# Altium project HPBIController.PrjPCB (part 2 of 5)

## Sheet Bank0-13-33.SchDoc: 02290_Sonoma_Controller
size B; ApprovedBy: J Johnson; CheckedBy: J Johnson; Author: sdfasdfdfAEFfasdFfaF; DrawnBy: J Johnson; Organization: Opsero Electronic Design; Address1: 21-915 Av. Marguerite-Bourgeoys; Address2: Québec (QC); Address3: G1S 3X4; DocumentNumber: OP009-001-SCH; Revision: B-1; SheetNumber: 07; SheetTotal: 16; Tel1: (581) 308-8830; Tel2: (581) 308-8830; Project: 02290_Sonoma_Controller; CheckedDate: 2013-12-13; Sheet: Bank0, Bank13 & Bank33; PageSetup: Record=PageOptions|CenterHorizontal=True|CenterVertical=True|PrintScale=1.08|XCorrection=1.00|YCorrection=1.00|PrintKind=0|BorderSize=5000000|LeftOffset=0|BottomOffset=0|Orientation=2|PaperLength=1000|PaperWidth=1000|Scale=100|PaperSource=7|PrintQuality=-4|MediaType=1|DitherType=10|PaperKind=Tabloid     [11 x 17 in]|PrintScaleMode=1; DrawDate: 2013-12-13; SchTitle: 02290_Sonoma_Controller; RevDescription: Removed QSPI, JP4/5, temp mon, JP6, U31; RevDate: 2019-05-24; RevBy: J Johnson; RevDescription2: Replaced D1 with RB521S30, J2 with L834-1G1T-S7; RevDescription3: Replaced FETs with TSM900N06CW RPG
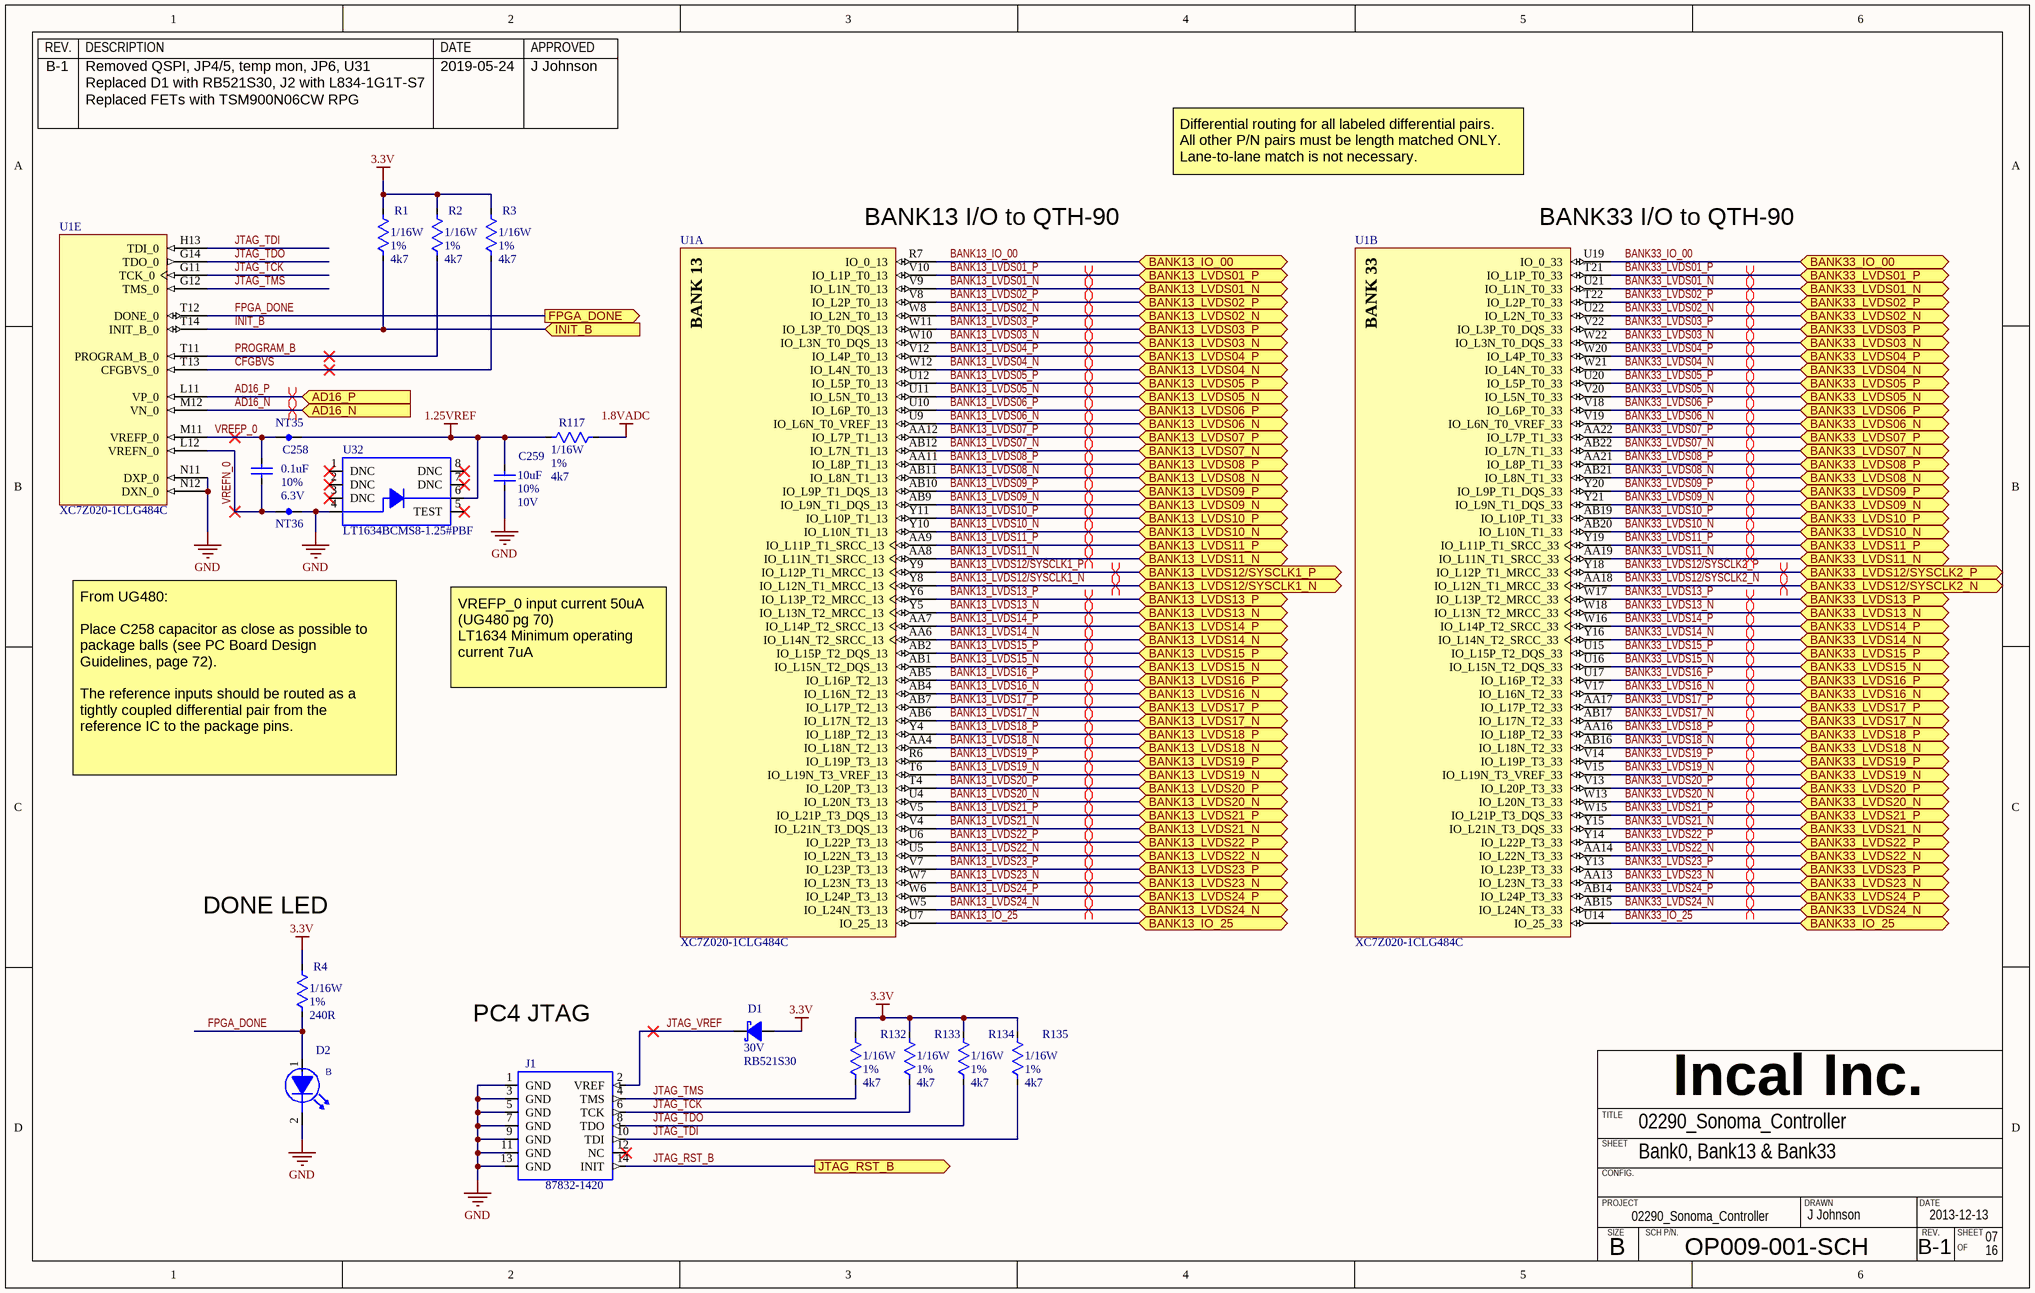
[diagram p1: Bank0-13-33.SchDoc]

### Parts
C258  value 0.1uF  Tolerance: 10%  Voltage: 6.3V  [CAPC0603X33N]  (hidden comment: CAPACITOR_NP_TYPE1)
C259  value 10uF  Tolerance: 10%  Voltage: 10V  [CAPC1608X38N]  (hidden comment: CAPACITOR_NP_TYPE1)
D1  value RB521S30  Voltage: 30V  [SOD15080X70]  (hidden comment: DIODE_SCHOTTKY_TYPE1)
D2  LED_BLU  [LEDM1608X38N-BLU]  (value not drawn)
J1  XILINX-JTAG-2x7  [87832-1420]  (value not drawn)
NT35  NET_TIE_1X1  [NET_TIE_1X1]  (value not drawn)  (net tie, no BOM)
NT36  NET_TIE_1X1  [NET_TIE_1X1]  (value not drawn)  (net tie, no BOM)
R1  value 4k7  Power: 1/16W  Tolerance: 1%  [RESC1005X33N]  (hidden comment: *)
R2  value 4k7  Power: 1/16W  Tolerance: 1%  [RESC1005X33N]  (hidden comment: *)
R3  value 4k7  Power: 1/16W  Tolerance: 1%  [RESC1005X33N]  (hidden comment: *)
R4  value 240R  Power: 1/16W  Tolerance: 1%  [RESC1005X33N]  (hidden comment: *)
R117  value 4k7  Power: 1/16W  Tolerance: 1%  [RESC1005X33N]  (hidden comment: *)
R132  value 4k7  Power: 1/16W  Tolerance: 1%  [RESC1005X33N]  (hidden comment: *)
R133  value 4k7  Power: 1/16W  Tolerance: 1%  [RESC1005X33N]  (hidden comment: *)
R134  value 4k7  Power: 1/16W  Tolerance: 1%  [RESC1005X33N]  (hidden comment: *)
R135  value 4k7  Power: 1/16W  Tolerance: 1%  [RESC1005X33N]  (hidden comment: *)
U1  XC7Z020-1CLG484C  [CLG484]  (parts A,B,E of 10)
U32  Mfg Part Number 1: LT1634BCMS8-1.25#PBF  [SOP65P490X110-8N]  (hidden comment: LT1634)

### Ports
AD16_N (in), AD16_P (in), BANK13_IO_00 (bidir), BANK13_IO_25 (bidir), BANK13_LVDS01_N (bidir), BANK13_LVDS01_P (bidir), BANK13_LVDS02_N (bidir), BANK13_LVDS02_P (bidir), BANK13_LVDS03_N (bidir), BANK13_LVDS03_P (bidir), BANK13_LVDS04_N (bidir), BANK13_LVDS04_P (bidir), BANK13_LVDS05_N (bidir), BANK13_LVDS05_P (bidir), BANK13_LVDS06_N (bidir), BANK13_LVDS06_P (bidir), BANK13_LVDS07_N (bidir), BANK13_LVDS07_P (bidir), BANK13_LVDS08_N (bidir), BANK13_LVDS08_P (bidir), BANK13_LVDS09_N (bidir), BANK13_LVDS09_P (bidir), BANK13_LVDS10_N (bidir), BANK13_LVDS10_P (bidir), BANK13_LVDS11_N (bidir), BANK13_LVDS11_P (bidir), BANK13_LVDS12/SYSCLK1_N (bidir), BANK13_LVDS12/SYSCLK1_P (bidir), BANK13_LVDS13_N (bidir), BANK13_LVDS13_P (bidir), BANK13_LVDS14_N (bidir), BANK13_LVDS14_P (bidir), BANK13_LVDS15_N (bidir), BANK13_LVDS15_P (bidir), BANK13_LVDS16_N (bidir), BANK13_LVDS16_P (bidir), BANK13_LVDS17_N (bidir), BANK13_LVDS17_P (bidir), BANK13_LVDS18_N (bidir), BANK13_LVDS18_P (bidir), BANK13_LVDS19_N (bidir), BANK13_LVDS19_P (bidir), BANK13_LVDS20_N (bidir), BANK13_LVDS20_P (bidir), BANK13_LVDS21_N (bidir), BANK13_LVDS21_P (bidir), BANK13_LVDS22_N (bidir), BANK13_LVDS22_P (bidir), BANK13_LVDS23_N (bidir), BANK13_LVDS23_P (bidir), BANK13_LVDS24_N (bidir), BANK13_LVDS24_P (bidir), BANK33_IO_00 (bidir), BANK33_IO_25 (bidir), BANK33_LVDS01_N (bidir), BANK33_LVDS01_P (bidir), BANK33_LVDS02_N (bidir), BANK33_LVDS02_P (bidir), BANK33_LVDS03_N (bidir), BANK33_LVDS03_P (bidir), BANK33_LVDS04_N (bidir), BANK33_LVDS04_P (bidir), BANK33_LVDS05_N (bidir), BANK33_LVDS05_P (bidir), BANK33_LVDS06_N (bidir), BANK33_LVDS06_P (bidir), BANK33_LVDS07_N (bidir), BANK33_LVDS07_P (bidir), BANK33_LVDS08_N (bidir), BANK33_LVDS08_P (bidir), BANK33_LVDS09_N (bidir), BANK33_LVDS09_P (bidir), BANK33_LVDS10_N (bidir), BANK33_LVDS10_P (bidir), BANK33_LVDS11_N (bidir), BANK33_LVDS11_P (bidir), BANK33_LVDS12/SYSCLK2_N (bidir), BANK33_LVDS12/SYSCLK2_P (bidir), BANK33_LVDS13_N (bidir), BANK33_LVDS13_P (bidir), BANK33_LVDS14_N (bidir), BANK33_LVDS14_P (bidir), BANK33_LVDS15_N (bidir), BANK33_LVDS15_P (bidir), BANK33_LVDS16_N (bidir), BANK33_LVDS16_P (bidir), BANK33_LVDS17_N (bidir), BANK33_LVDS17_P (bidir), BANK33_LVDS18_N (bidir), BANK33_LVDS18_P (bidir), BANK33_LVDS19_N (bidir), BANK33_LVDS19_P (bidir), BANK33_LVDS20_N (bidir), BANK33_LVDS20_P (bidir), BANK33_LVDS21_N (bidir), BANK33_LVDS21_P (bidir), BANK33_LVDS22_N (bidir), BANK33_LVDS22_P (bidir), BANK33_LVDS23_N (bidir), BANK33_LVDS23_P (bidir), BANK33_LVDS24_N (bidir), BANK33_LVDS24_P (bidir), FPGA_DONE (out), INIT_B (in), JTAG_RST_B (out)

### Nets
1.8VADC: R117.2
1.25VREF: C259.1 NT35.2 R117.1 U32.6(VOUT)
3.3V: D1.1(A) R1.2 R2.2 R3.2 R4.2 R132.2 R133.2 R134.2 R135.2
GND: C259.2 D2.2(K) J1.1(GND) J1.3(GND) J1.5(GND) J1.7(GND) J1.9(GND) J1.11(GND) J1.13(GND) NT36.2 U1.N11(DXP_0) U1.N12(DXN_0) U32.4(GND)
AD16_N: U1.M12(VN_0) ; port AD16_N
AD16_P: U1.L11(VP_0) ; port AD16_P
BANK13_IO_00: U1.R7(IO_0_13) ; port BANK13_IO_00
BANK13_IO_25: U1.U7(IO_25_13) ; port BANK13_IO_25
BANK13_LVDS01_N: U1.V9(IO_L1N_T0_13) ; port BANK13_LVDS01_N
BANK13_LVDS01_P: U1.V10(IO_L1P_T0_13) ; port BANK13_LVDS01_P
BANK13_LVDS02_N: U1.W8(IO_L2N_T0_13) ; port BANK13_LVDS02_N
BANK13_LVDS02_P: U1.V8(IO_L2P_T0_13) ; port BANK13_LVDS02_P
BANK13_LVDS03_N: U1.W10(IO_L3N_T0_DQS_13) ; port BANK13_LVDS03_N
BANK13_LVDS03_P: U1.W11(IO_L3P_T0_DQS_13) ; port BANK13_LVDS03_P
BANK13_LVDS04_N: U1.W12(IO_L4N_T0_13) ; port BANK13_LVDS04_N
BANK13_LVDS04_P: U1.V12(IO_L4P_T0_13) ; port BANK13_LVDS04_P
BANK13_LVDS05_N: U1.U11(IO_L5N_T0_13) ; port BANK13_LVDS05_N
BANK13_LVDS05_P: U1.U12(IO_L5P_T0_13) ; port BANK13_LVDS05_P
BANK13_LVDS06_N: U1.U9(IO_L6N_T0_VREF_13) ; port BANK13_LVDS06_N
BANK13_LVDS06_P: U1.U10(IO_L6P_T0_13) ; port BANK13_LVDS06_P
BANK13_LVDS07_N: U1.AB12(IO_L7N_T1_13) ; port BANK13_LVDS07_N
BANK13_LVDS07_P: U1.AA12(IO_L7P_T1_13) ; port BANK13_LVDS07_P
BANK13_LVDS08_N: U1.AB11(IO_L8N_T1_13) ; port BANK13_LVDS08_N
BANK13_LVDS08_P: U1.AA11(IO_L8P_T1_13) ; port BANK13_LVDS08_P
BANK13_LVDS09_N: U1.AB9(IO_L9N_T1_DQS_13) ; port BANK13_LVDS09_N
BANK13_LVDS09_P: U1.AB10(IO_L9P_T1_DQS_13) ; port BANK13_LVDS09_P
BANK13_LVDS10_N: U1.Y10(IO_L10N_T1_13) ; port BANK13_LVDS10_N
BANK13_LVDS10_P: U1.Y11(IO_L10P_T1_13) ; port BANK13_LVDS10_P
BANK13_LVDS11_N: U1.AA8(IO_L11N_T1_SRCC_13) ; port BANK13_LVDS11_N
BANK13_LVDS11_P: U1.AA9(IO_L11P_T1_SRCC_13) ; port BANK13_LVDS11_P
BANK13_LVDS12/SYSCLK1_N: U1.Y8(IO_L12N_T1_MRCC_13) ; port BANK13_LVDS12/SYSCLK1_N
BANK13_LVDS12/SYSCLK1_P: U1.Y9(IO_L12P_T1_MRCC_13) ; port BANK13_LVDS12/SYSCLK1_P
BANK13_LVDS13_N: U1.Y5(IO_L13N_T2_MRCC_13) ; port BANK13_LVDS13_N
BANK13_LVDS13_P: U1.Y6(IO_L13P_T2_MRCC_13) ; port BANK13_LVDS13_P
BANK13_LVDS14_N: U1.AA6(IO_L14N_T2_SRCC_13) ; port BANK13_LVDS14_N
BANK13_LVDS14_P: U1.AA7(IO_L14P_T2_SRCC_13) ; port BANK13_LVDS14_P
BANK13_LVDS15_N: U1.AB1(IO_L15N_T2_DQS_13) ; port BANK13_LVDS15_N
BANK13_LVDS15_P: U1.AB2(IO_L15P_T2_DQS_13) ; port BANK13_LVDS15_P
BANK13_LVDS16_N: U1.AB4(IO_L16N_T2_13) ; port BANK13_LVDS16_N
BANK13_LVDS16_P: U1.AB5(IO_L16P_T2_13) ; port BANK13_LVDS16_P
BANK13_LVDS17_N: U1.AB6(IO_L17N_T2_13) ; port BANK13_LVDS17_N
BANK13_LVDS17_P: U1.AB7(IO_L17P_T2_13) ; port BANK13_LVDS17_P
BANK13_LVDS18_N: U1.AA4(IO_L18N_T2_13) ; port BANK13_LVDS18_N
BANK13_LVDS18_P: U1.Y4(IO_L18P_T2_13) ; port BANK13_LVDS18_P
BANK13_LVDS19_N: U1.T6(IO_L19N_T3_VREF_13) ; port BANK13_LVDS19_N
BANK13_LVDS19_P: U1.R6(IO_L19P_T3_13) ; port BANK13_LVDS19_P
BANK13_LVDS20_N: U1.U4(IO_L20N_T3_13) ; port BANK13_LVDS20_N
BANK13_LVDS20_P: U1.T4(IO_L20P_T3_13) ; port BANK13_LVDS20_P
BANK13_LVDS21_N: U1.V4(IO_L21N_T3_DQS_13) ; port BANK13_LVDS21_N
BANK13_LVDS21_P: U1.V5(IO_L21P_T3_DQS_13) ; port BANK13_LVDS21_P
BANK13_LVDS22_N: U1.U5(IO_L22N_T3_13) ; port BANK13_LVDS22_N
BANK13_LVDS22_P: U1.U6(IO_L22P_T3_13) ; port BANK13_LVDS22_P
BANK13_LVDS23_N: U1.W7(IO_L23N_T3_13) ; port BANK13_LVDS23_N
BANK13_LVDS23_P: U1.V7(IO_L23P_T3_13) ; port BANK13_LVDS23_P
BANK13_LVDS24_N: U1.W5(IO_L24N_T3_13) ; port BANK13_LVDS24_N
BANK13_LVDS24_P: U1.W6(IO_L24P_T3_13) ; port BANK13_LVDS24_P
BANK33_IO_00: U1.U19(IO_0_33) ; port BANK33_IO_00
BANK33_IO_25: U1.U14(IO_25_33) ; port BANK33_IO_25
BANK33_LVDS01_N: U1.U21(IO_L1N_T0_33) ; port BANK33_LVDS01_N
BANK33_LVDS01_P: U1.T21(IO_L1P_T0_33) ; port BANK33_LVDS01_P
BANK33_LVDS02_N: U1.U22(IO_L2N_T0_33) ; port BANK33_LVDS02_N
BANK33_LVDS02_P: U1.T22(IO_L2P_T0_33) ; port BANK33_LVDS02_P
BANK33_LVDS03_N: U1.W22(IO_L3N_T0_DQS_33) ; port BANK33_LVDS03_N
BANK33_LVDS03_P: U1.V22(IO_L3P_T0_DQS_33) ; port BANK33_LVDS03_P
BANK33_LVDS04_N: U1.W21(IO_L4N_T0_33) ; port BANK33_LVDS04_N
BANK33_LVDS04_P: U1.W20(IO_L4P_T0_33) ; port BANK33_LVDS04_P
BANK33_LVDS05_N: U1.V20(IO_L5N_T0_33) ; port BANK33_LVDS05_N
BANK33_LVDS05_P: U1.U20(IO_L5P_T0_33) ; port BANK33_LVDS05_P
BANK33_LVDS06_N: U1.V19(IO_L6N_T0_VREF_33) ; port BANK33_LVDS06_N
BANK33_LVDS06_P: U1.V18(IO_L6P_T0_33) ; port BANK33_LVDS06_P
BANK33_LVDS07_N: U1.AB22(IO_L7N_T1_33) ; port BANK33_LVDS07_N
BANK33_LVDS07_P: U1.AA22(IO_L7P_T1_33) ; port BANK33_LVDS07_P
BANK33_LVDS08_N: U1.AB21(IO_L8N_T1_33) ; port BANK33_LVDS08_N
BANK33_LVDS08_P: U1.AA21(IO_L8P_T1_33) ; port BANK33_LVDS08_P
BANK33_LVDS09_N: U1.Y21(IO_L9N_T1_DQS_33) ; port BANK33_LVDS09_N
BANK33_LVDS09_P: U1.Y20(IO_L9P_T1_DQS_33) ; port BANK33_LVDS09_P
BANK33_LVDS10_N: U1.AB20(IO_L10N_T1_33) ; port BANK33_LVDS10_N
BANK33_LVDS10_P: U1.AB19(IO_L10P_T1_33) ; port BANK33_LVDS10_P
BANK33_LVDS11_N: U1.AA19(IO_L11N_T1_SRCC_33) ; port BANK33_LVDS11_N
BANK33_LVDS11_P: U1.Y19(IO_L11P_T1_SRCC_33) ; port BANK33_LVDS11_P
BANK33_LVDS12/SYSCLK2_N: U1.AA18(IO_L12N_T1_MRCC_33) ; port BANK33_LVDS12/SYSCLK2_N
BANK33_LVDS12/SYSCLK2_P: U1.Y18(IO_L12P_T1_MRCC_33) ; port BANK33_LVDS12/SYSCLK2_P
BANK33_LVDS13_N: U1.W18(IO_L13N_T2_MRCC_33) ; port BANK33_LVDS13_N
BANK33_LVDS13_P: U1.W17(IO_L13P_T2_MRCC_33) ; port BANK33_LVDS13_P
BANK33_LVDS14_N: U1.Y16(IO_L14N_T2_SRCC_33) ; port BANK33_LVDS14_N
BANK33_LVDS14_P: U1.W16(IO_L14P_T2_SRCC_33) ; port BANK33_LVDS14_P
BANK33_LVDS15_N: U1.U16(IO_L15N_T2_DQS_33) ; port BANK33_LVDS15_N
BANK33_LVDS15_P: U1.U15(IO_L15P_T2_DQS_33) ; port BANK33_LVDS15_P
BANK33_LVDS16_N: U1.V17(IO_L16N_T2_33) ; port BANK33_LVDS16_N
BANK33_LVDS16_P: U1.U17(IO_L16P_T2_33) ; port BANK33_LVDS16_P
BANK33_LVDS17_N: U1.AB17(IO_L17N_T2_33) ; port BANK33_LVDS17_N
BANK33_LVDS17_P: U1.AA17(IO_L17P_T2_33) ; port BANK33_LVDS17_P
BANK33_LVDS18_N: U1.AB16(IO_L18N_T2_33) ; port BANK33_LVDS18_N
BANK33_LVDS18_P: U1.AA16(IO_L18P_T2_33) ; port BANK33_LVDS18_P
BANK33_LVDS19_N: U1.V15(IO_L19N_T3_VREF_33) ; port BANK33_LVDS19_N
BANK33_LVDS19_P: U1.V14(IO_L19P_T3_33) ; port BANK33_LVDS19_P
BANK33_LVDS20_N: U1.W13(IO_L20N_T3_33) ; port BANK33_LVDS20_N
BANK33_LVDS20_P: U1.V13(IO_L20P_T3_33) ; port BANK33_LVDS20_P
BANK33_LVDS21_N: U1.Y15(IO_L21N_T3_DQS_33) ; port BANK33_LVDS21_N
BANK33_LVDS21_P: U1.W15(IO_L21P_T3_DQS_33) ; port BANK33_LVDS21_P
BANK33_LVDS22_N: U1.AA14(IO_L22N_T3_33) ; port BANK33_LVDS22_N
BANK33_LVDS22_P: U1.Y14(IO_L22P_T3_33) ; port BANK33_LVDS22_P
BANK33_LVDS23_N: U1.AA13(IO_L23N_T3_33) ; port BANK33_LVDS23_N
BANK33_LVDS23_P: U1.Y13(IO_L23P_T3_33) ; port BANK33_LVDS23_P
BANK33_LVDS24_N: U1.AB15(IO_L24N_T3_33) ; port BANK33_LVDS24_N
BANK33_LVDS24_P: U1.AB14(IO_L24P_T3_33) ; port BANK33_LVDS24_P
CFGBVS: R3.1 U1.T13(CFGBVS_0)
FPGA_DONE: D2.1(A) R4.1 U1.T12(DONE_0) ; port FPGA_DONE
INIT_B: R1.1 U1.T14(INIT_B_0) ; port INIT_B
JTAG_RST_B: J1.14(INIT) ; port JTAG_RST_B
JTAG_TCK: J1.6(TCK) R133.1 U1.G11(TCK_0)
JTAG_TDI: J1.10(TDI) R135.1 U1.H13(TDI_0)
JTAG_TDO: J1.8(TDO) R134.1 U1.G14(TDO_0)
JTAG_TMS: J1.4(TMS) R132.1 U1.G12(TMS_0)
JTAG_VREF: D1.2(K) J1.2(VREF)
PROGRAM_B: R2.1 U1.T11(PROGRAM_B_0)
VREFN_0: C258.2 NT36.1 U1.L12(VREFN_0)
VREFP_0: C258.1 NT35.1 U1.M11(VREFP_0)

Not connected (* = marked no-connect by the designer): J1 12(NC)*; U32 1(DNC)* 2(DNC)* 3(DNC)* 5(TEST)* 7(DNC)* 8(DNC)*

### Layout directives
differential pair: AD16_N, AD16_P, BANK13_LVDS01_N, BANK13_LVDS01_P, BANK13_LVDS02_N, BANK13_LVDS02_P, BANK13_LVDS03_N, BANK13_LVDS03_P, BANK13_LVDS04_N, BANK13_LVDS04_P, BANK13_LVDS05_N, BANK13_LVDS05_P, BANK13_LVDS06_N, BANK13_LVDS06_P, BANK13_LVDS07_N, BANK13_LVDS07_P, BANK13_LVDS08_N, BANK13_LVDS08_P, BANK13_LVDS09_N, BANK13_LVDS09_P, BANK13_LVDS10_N, BANK13_LVDS10_P, BANK13_LVDS11_N, BANK13_LVDS11_P, BANK13_LVDS12/SYSCLK1_N, BANK13_LVDS12/SYSCLK1_P, BANK13_LVDS13_N, BANK13_LVDS13_P, BANK13_LVDS14_N, BANK13_LVDS14_P, BANK13_LVDS15_N, BANK13_LVDS15_P, BANK13_LVDS16_N, BANK13_LVDS16_P, BANK13_LVDS17_N, BANK13_LVDS17_P, BANK13_LVDS18_N, BANK13_LVDS18_P, BANK13_LVDS19_N, BANK13_LVDS19_P, BANK13_LVDS20_N, BANK13_LVDS20_P, BANK13_LVDS21_N, BANK13_LVDS21_P, BANK13_LVDS22_N, BANK13_LVDS22_P, BANK13_LVDS23_N, BANK13_LVDS23_P, BANK13_LVDS24_N, BANK13_LVDS24_P, BANK33_LVDS01_N, BANK33_LVDS01_P, BANK33_LVDS02_N, BANK33_LVDS02_P, BANK33_LVDS03_N, BANK33_LVDS03_P, BANK33_LVDS04_N, BANK33_LVDS04_P, BANK33_LVDS05_N, BANK33_LVDS05_P, BANK33_LVDS06_N, BANK33_LVDS06_P, BANK33_LVDS07_N, BANK33_LVDS07_P, BANK33_LVDS08_N, BANK33_LVDS08_P, BANK33_LVDS09_N, BANK33_LVDS09_P, BANK33_LVDS10_N, BANK33_LVDS10_P, BANK33_LVDS11_N, BANK33_LVDS11_P, BANK33_LVDS12/SYSCLK2_N, BANK33_LVDS12/SYSCLK2_P, BANK33_LVDS13_N, BANK33_LVDS13_P, BANK33_LVDS14_N, BANK33_LVDS14_P, BANK33_LVDS15_N, BANK33_LVDS15_P, BANK33_LVDS16_N, BANK33_LVDS16_P, BANK33_LVDS17_N, BANK33_LVDS17_P, BANK33_LVDS18_N, BANK33_LVDS18_P, BANK33_LVDS19_N, BANK33_LVDS19_P, BANK33_LVDS20_N, BANK33_LVDS20_P, BANK33_LVDS21_N, BANK33_LVDS21_P, BANK33_LVDS22_N, BANK33_LVDS22_P, BANK33_LVDS23_N, BANK33_LVDS23_P, BANK33_LVDS24_N, BANK33_LVDS24_P

### Notes on the sheet
- (near U1) BANK13 I/O to QTH-90
- Differential routing for all labeled differential pairs.
  All other P/N pairs must be length matched ONLY.
  Lane-to-lane match is not necessary.
- (near U1) BANK33 I/O to QTH-90
- VREFP_0 input current 50uA (UG480 pg 70)
  LT1634 Minimum operating current 7uA
- From UG480:
  Place C258 capacitor as close as possible to package balls (see PC Board Design Guidelines, page 72).
  The reference inputs should be routed as a tightly coupled differential pair from the
  reference IC to the package pins.
- (near R4) DONE LED
- PC4 JTAG
- REV.
- DESCRIPTION
- DATE
- APPROVED
- Incal Inc.
- SHEET
- TITLE
- CONFIG.
- PROJECT
- SIZE
- SCH P/N.
- DRAWN
- B
- OF
- (in symbol LTST-C191TBKT) B
- (in symbol XC7Z020-1CLG484C, part A) BANK 13
- (in symbol XC7Z020-1CLG484C, part B) BANK 33

### Library data of the parts
C258 = C0201_0.1uF_10%_6.3V_X5R: Capacitor ceramic, X5R, 0.1uF, 6.3V, 10%, -55 to +125 C, EIA0201; Manufacturer 1: Murata; Mfg Part Number 1: GRM033R60J104KE19D; EIA(I) Package: 0201; EIA(M) Package: 0603; ASSY: USED; Status: Active; Power: *; Current: *; Part Ref: C0201_0.1uF_10%_6.3V_X5R; Comment_1: *; RoHs: True; Operating Temp: -55 to +85 C
C259 = C0603_10uF_10%_10V_X5R: Capacitor ceramic, X5R, 10uF, 10V, 10%, -55 to +85 C, EIA0603; Manufacturer 1: TDK Corporation; Mfg Part Number 1: C1608X5R1A106K080AC; EIA(I) Package: 0603; EIA(M) Package: 1608; ASSY: USED; Status: Active; Power: *; Current: *; Part Ref: C0603_10uF_10%_10V_X5R; Comment_1: *; RoHs: True; Operating Temp: -55 to +85 C
D1 = RB521S30: Diode schottky, 30V, 200mA, SOD-523F; Manufacturer 1: ON Semiconductor; Status: Active; Power: *; Current: 200mA; EIA(I) Package: *; EIA(M) Package: *; Part Ref: RB521S30; Tolerance: *; RoHs: True; Package: SOD-523F; Datasheet 1: https://www.onsemi.com/pub/Collateral/RB521S30-D.pdf; Mfg Part Number 1: RB521S30; Operating Temp: -55 to +125 C
D2 = LTST-C191TBKT: Led, Blue, 150mcd, SMT, LTST-C191TBKT, -20 to +80 C, 0603; Manufacturer 1: LITE-ON; EIA(I) Package: 0603; ASSY: USED; Power: 120mW; Current: 20mA; Voltage: 3.2V; Status: Active; EIA(M) Package: *; Part Ref: LTST-C191TBKT; Tolerance: *; Package: *; RoHs: True; Value: LTST-C191TBKT; Operating Temp: -20 to +80 C; Mfg Part Number 1: LTST-C191TBKT
J1 = JTAG_XILINX_SMT_2X7: Connector Header 2mm, 2x7, SMT, Keyed, Shrouded, 0V, 0A, -55 to +105 C; Manufacturer 1: Molex; ASSY: USED; Power: Pow; Comment_1: Com; Value: 87832-1420; Status: Active; EIA(I) Package: *; EIA(M) Package: *; Part Ref: JTAG_XILINX_SMT_2X7; Current: 0A; Tolerance: *; Voltage: 0V; Package: *; RoHs: True; Operating Temp: -55 to +105 C; Mfg Part Number 1: 87832-1420; Datasheet 1: ..\datasheet\Connector\Molex\Header\87831-1420\2012-10-25\
NT35 NT36 = NET_TIE_1X1: Net Tie 1 to 1; ASSY: USED; Status: Active; Power: *; Current: *; EIA(I) Package: *; EIA(M) Package: *; Part Ref: NET_TIE_1X1; Comment_1: *; RoHs: True; Value: NET_TIE; Tolerance: *; Voltage: *
R1-R3 R117 R132-R135 = R0402_4k70_1%: Resistor, 4k7, 1/16W, 1%, -55 to +155 C, EIA0402; Manufacturer 1: Yageo; Mfg Part Number 1: RC0402FR-074k7L; EIA(I) Package: 0402; EIA(M) Package: 1005; Voltage: 50V; ASSY: USED; Status: Active; Part Ref: R0402_4k70_1%; Current: *; Comment_1: *; RoHs: True; Operating Temp: -55 to +155 C; Datasheet 1: ..\datasheet\Resistor\Yaego\Thick_Film\RC0402\2012-03-29; Manufacturer 2: Vishay Dale; Mfg Part Number 2: CRCW04024k70FKED; Datasheet 2: ..\datasheet\Resistor\Vishay Dale\CRC\2012-03-29
R4 = R0402_240R_1%: Resistor, 240R, 1/16W, 1%, -50 to +155 C, EIA0402, EIA(M)1005; Manufacturer 1: Vishay Dale; Mfg Part Number 1: CRCW0402240RFKED; EIA(I) Package: 0402; EIA(M) Package: 1005; Voltage: 50V; ASSY: USED; Status: Active; Part Ref: R0402_240R_1%; Current: *; Comment_1: *; RoHs: True; Operating Temp: -50 to +155 C
U1 = XC7Z020-1CLG484C: 667 MHz Zynq™-7000 AP SoC, 130 PS I/O, 200 FPGA I/O, 484-Ball BGA, Speed Grade 1, Commercial Grade; Manufacturer: Xilinx; Extensible Block RAM (# 36Kb Blocks): 560 KB (140); Flip Flops: 106400; LUTs: 53200; Speed Grade: -1; DatasheetVersion: v1.2; PackageVersion: Rev 1.1; PackageReference: CLG484; PackageDescription: Wire-Bond Chip-Scale BGA, Body 19 x 19 mm, 0.8 mm Pitch; Generic Part Number: XC7Z020; RoHS: True; Mounting Technology: Surface Mount; Code_JEDEC: MO-275-PPAA-2; PartNumber: XC7Z020-1CLG484C; ComponentLink1Description: Datasheet; ComponentLink1URL: http://www.xilinx.com/support/documentation/data_sheets/ds190-Zynq-7000-Overview.pdf; ComponentLink2Description: Package Specification; ComponentLink2URL: http://www.xilinx.com/support/documentation/user_guides/ug865-Zynq-7000-Pkg-Pinout.pdf; ComponentLink3Description: DC and AC Switching Characteristics; ComponentLink3URL: http://www.xilinx.com/support/documentation/data_sheets/ds187-XC7Z010-XC7Z020-Data-Sheet.pdf; ComponentLink4Description: Package File; ComponentLink4URL: http://www.xilinx.com/support/packagefiles/z7packages/xc7z020clg484pkg.txt; ComponentLink5Description: Packaging and Pinout; ComponentLink5URL: http://www.xilinx.com/support/documentation/user_guides/ug865-Zynq-7000-Pkg-Pinout.pdf; ComponentLink6Description: PCB and Layout Guide; ComponentLink6URL: http://www.xilinx.com/support/documentation/user_guides/ug483_7Series_PCB.pdf; Part Ref: XC7Z020-1CLG484C; Status: Active; Value: XC7Z020-1CLG484C; Manufacturer 1: Xilinx; Mfg Part Number 1: XC7Z020-1CLG484C; Package: CLG484
U32 = LT1634BCMS8-1.25#PBF: Reference Shunt 1.25V, 10ppm, 0.05%; Manufacturer 1: Linear Technology; ASSY: USED; Power: Pow; Current: Cur; Voltage: Vol; Status: Active; EIA(I) Package: *; EIA(M) Package: *; Part Ref: LT1634BCMS8-1.25#PBF; Tolerance: ±0.05%; Package: SOT23-5; RoHs: True; Value: 1.25V; Operating Temp: 0 to +70 C

## Sheet DDR3A.SchDoc: 02290_Sonoma_Controller
size B; ApprovedBy: J Johnson; CheckedBy: J Johnson; Author: sdfasdfdfAEFfasdFfaF; DrawnBy: J Johnson; Organization: Opsero Electronic Design; Address1: 21-915 Av. Marguerite-Bourgeoys; Address2: Québec (QC); Address3: G1S 3X4; DocumentNumber: OP009-001-SCH; Revision: B-1; SheetNumber: 03; SheetTotal: 16; Tel1: (581) 308-8830; Tel2: (581) 308-8830; Project: 02290_Sonoma_Controller; CheckedDate: 2013-12-13; Sheet: DDR3 SDRAM Page 1; PageSetup: Record=PageOptions|CenterHorizontal=True|CenterVertical=True|PrintScale=1.08|XCorrection=1.00|YCorrection=1.00|PrintKind=0|BorderSize=5000000|LeftOffset=0|BottomOffset=0|Orientation=2|PaperLength=1000|PaperWidth=1000|Scale=100|PaperSource=7|PrintQuality=-4|MediaType=1|DitherType=10|PaperKind=Tabloid     [11 x 17 in]|PrintScaleMode=1; DrawDate: 2013-12-13; SchTitle: 02290_Sonoma_Controller; RevDescription: Removed QSPI, JP4/5, temp mon, JP6, U31; RevDate: 2019-05-24; RevBy: J Johnson; RevDescription2: Replaced D1 with RB521S30, J2 with L834-1G1T-S7; RevDescription3: Replaced FETs with TSM900N06CW RPG
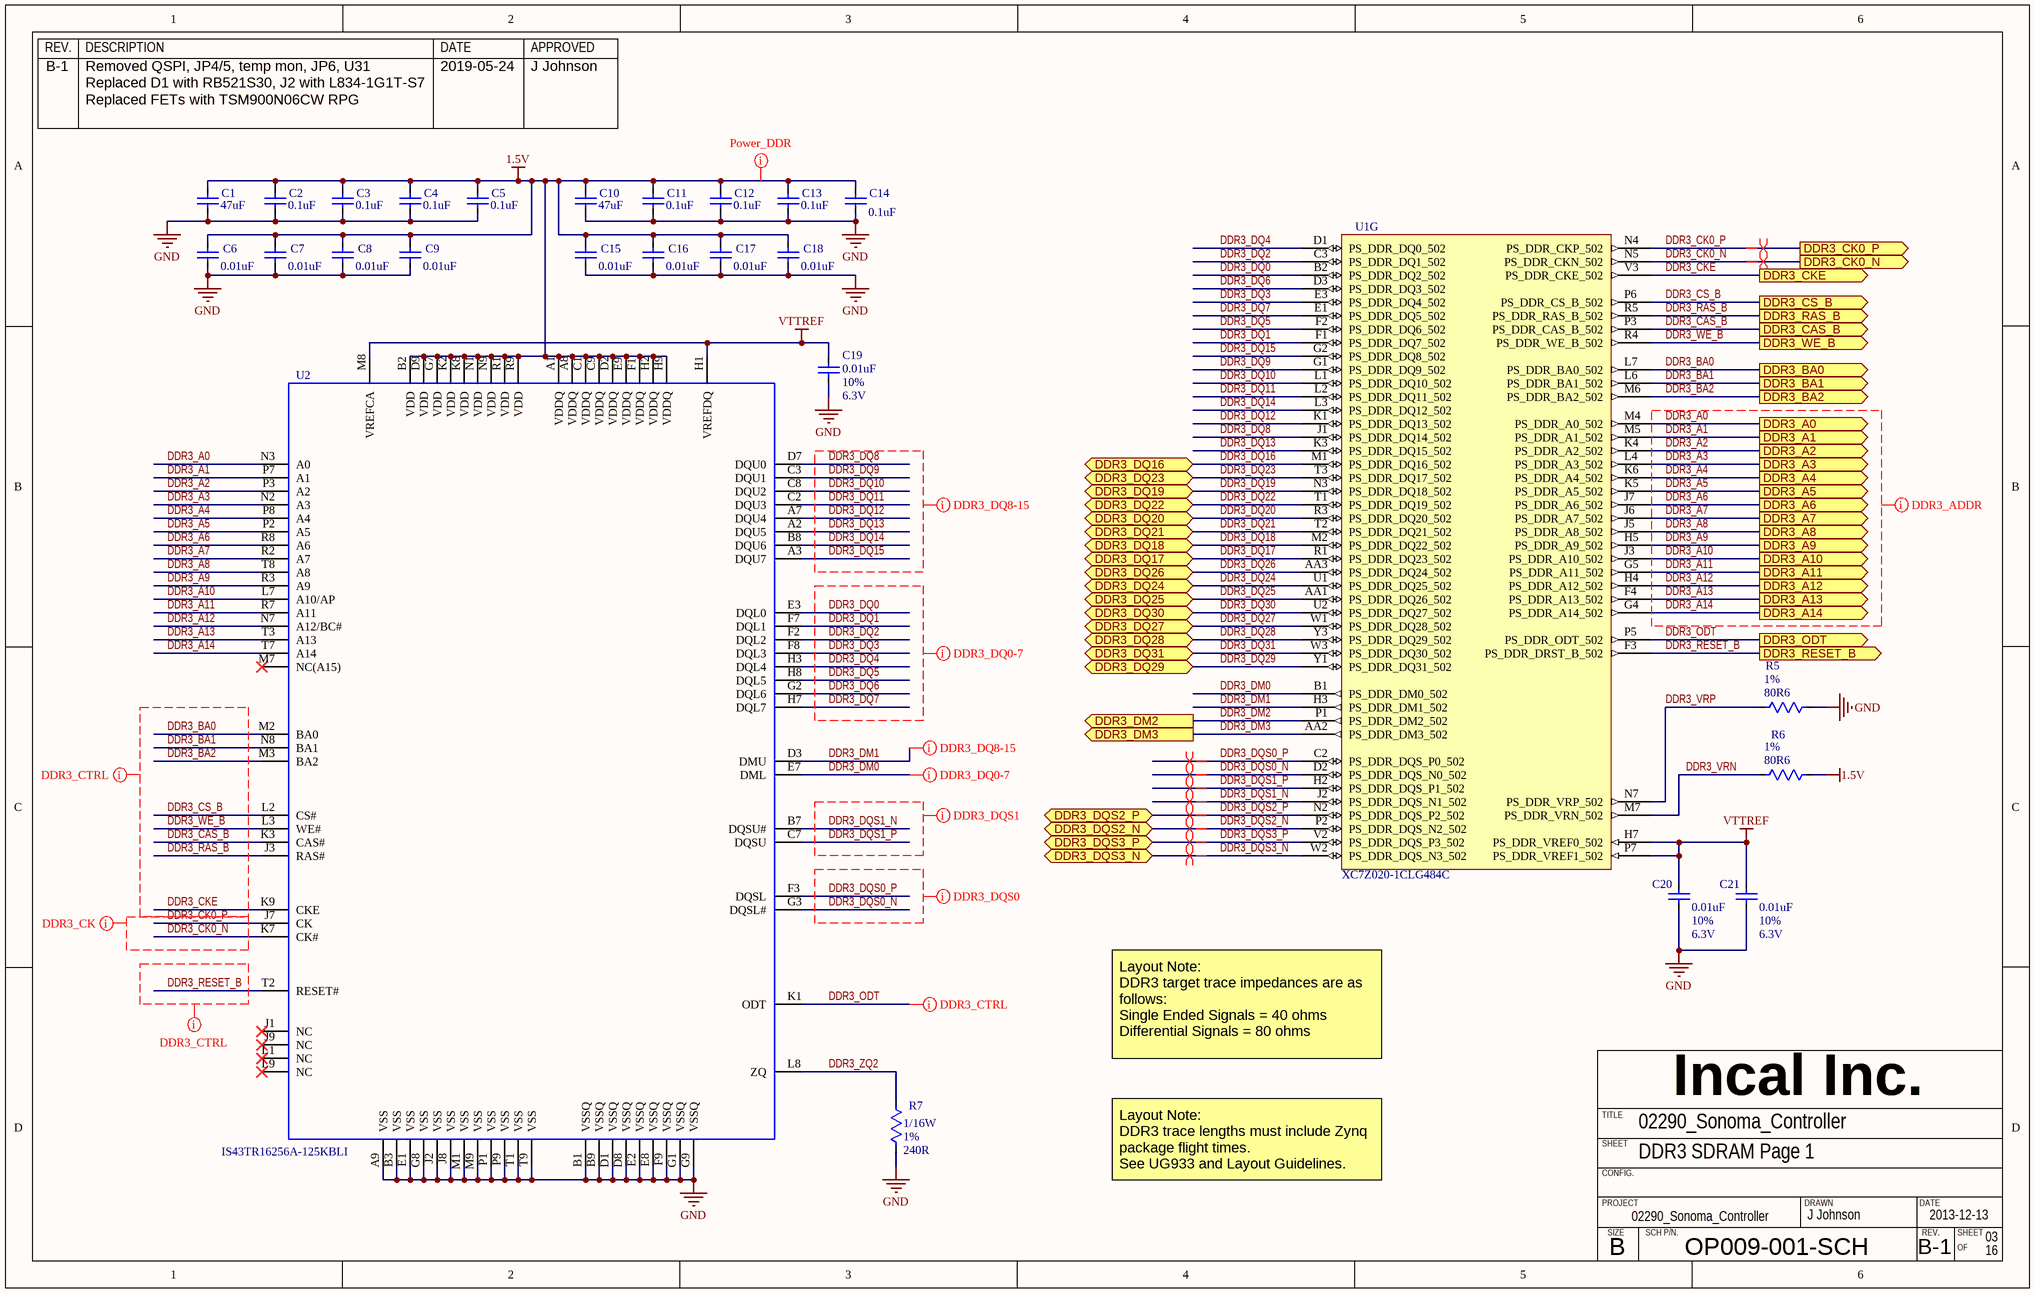
[diagram p2: DDR3A.SchDoc]

### Parts
C1  value 47uF  [CAPC2013X125N]  (hidden comment: CAPACITOR_NP_TYPE1)
C2  value 0.1uF  [CAPC0603X33N]  (hidden comment: CAPACITOR_NP_TYPE1)
C3  value 0.1uF  [CAPC0603X33N]  (hidden comment: CAPACITOR_NP_TYPE1)
C4  value 0.1uF  [CAPC0603X33N]  (hidden comment: CAPACITOR_NP_TYPE1)
C5  value 0.1uF  [CAPC0603X33N]  (hidden comment: CAPACITOR_NP_TYPE1)
C6  value 0.01uF  [CAPC0603X33N]  (hidden comment: CAPACITOR_NP_TYPE1)
C7  value 0.01uF  [CAPC0603X33N]  (hidden comment: CAPACITOR_NP_TYPE1)
C8  value 0.01uF  [CAPC0603X33N]  (hidden comment: CAPACITOR_NP_TYPE1)
C9  value 0.01uF  [CAPC0603X33N]  (hidden comment: CAPACITOR_NP_TYPE1)
C10  value 47uF  [CAPC2013X125N]  (hidden comment: CAPACITOR_NP_TYPE1)
C11  value 0.1uF  [CAPC0603X33N]  (hidden comment: CAPACITOR_NP_TYPE1)
C12  value 0.1uF  [CAPC0603X33N]  (hidden comment: CAPACITOR_NP_TYPE1)
C13  value 0.1uF  [CAPC0603X33N]  (hidden comment: CAPACITOR_NP_TYPE1)
C14  value 0.1uF  [CAPC0603X33N]  (hidden comment: CAPACITOR_NP_TYPE1)
C15  value 0.01uF  [CAPC0603X33N]  (hidden comment: CAPACITOR_NP_TYPE1)
C16  value 0.01uF  [CAPC0603X33N]  (hidden comment: CAPACITOR_NP_TYPE1)
C17  value 0.01uF  [CAPC0603X33N]  (hidden comment: CAPACITOR_NP_TYPE1)
C18  value 0.01uF  [CAPC0603X33N]  (hidden comment: CAPACITOR_NP_TYPE1)
C19  value 0.01uF  Tolerance: 10%  Voltage: 6.3V  [CAPC0603X33N]  (hidden comment: CAPACITOR_NP_TYPE1)
C20  value 0.01uF  Tolerance: 10%  Voltage: 6.3V  [CAPC0603X33N]  (hidden comment: CAPACITOR_NP_TYPE1)
C21  value 0.01uF  Tolerance: 10%  Voltage: 6.3V  [CAPC0603X33N]  (hidden comment: CAPACITOR_NP_TYPE1)
R5  value 80R6  Tolerance: 1%  [RESC1005X33N]  (hidden comment: *)
R6  value 80R6  Tolerance: 1%  [RESC1005X33N]  (hidden comment: *)
R7  value 240R  Power: 1/16W  Tolerance: 1%  [RESC1005X33N]  (hidden comment: *)
U1  XC7Z020-1CLG484C  [CLG484]  (part G of 10)
U2  IS43TR16256A-125KBLI  [BGA96C80P6X16_900X1300X120]

### Ports
DDR3_A0 (out), DDR3_A1 (out), DDR3_A2 (out), DDR3_A3 (out), DDR3_A4 (out), DDR3_A5 (out), DDR3_A6 (out), DDR3_A7 (out), DDR3_A8 (out), DDR3_A9 (out), DDR3_A10 (out), DDR3_A11 (out), DDR3_A12 (out), DDR3_A13 (out), DDR3_A14 (out), DDR3_BA0 (out), DDR3_BA1 (out), DDR3_BA2 (out), DDR3_CAS_B (out), DDR3_CK0_N (out), DDR3_CK0_P (out), DDR3_CKE (out), DDR3_CS_B (out), DDR3_DM2 (out), DDR3_DM3 (out), DDR3_DQ16 (bidir), DDR3_DQ17 (bidir), DDR3_DQ18 (bidir), DDR3_DQ19 (bidir), DDR3_DQ20 (bidir), DDR3_DQ21 (bidir), DDR3_DQ22 (bidir), DDR3_DQ23 (bidir), DDR3_DQ24 (bidir), DDR3_DQ25 (bidir), DDR3_DQ26 (bidir), DDR3_DQ27 (bidir), DDR3_DQ28 (bidir), DDR3_DQ29 (bidir), DDR3_DQ30 (bidir), DDR3_DQ31 (bidir), DDR3_DQS2_N (bidir), DDR3_DQS2_P (bidir), DDR3_DQS3_N (bidir), DDR3_DQS3_P (bidir), DDR3_ODT (out), DDR3_RAS_B (out), DDR3_RESET_B (out), DDR3_WE_B (out)

### Nets
1.5V: C1.1 C2.1 C3.1 C4.1 C5.1 C6.1 C7.1 C8.1 C9.1 C10.1 C11.1 C12.1 C13.1 C14.1 C15.1 C16.1 C17.1 C18.1 R6.1 U2.A1(VDDQ) U2.A8(VDDQ) U2.B2(VDD) U2.C1(VDDQ) U2.C9(VDDQ) U2.D2(VDDQ) U2.D9(VDD) U2.E9(VDDQ) U2.F1(VDDQ) U2.G7(VDD) U2.H2(VDDQ) U2.H9(VDDQ) U2.K2(VDD) U2.K8(VDD) U2.N1(VDD) U2.N9(VDD) U2.R1(VDD) U2.R9(VDD)
GND: C1.2 C2.2 C3.2 C4.2 C5.2 C6.2 C7.2 C8.2 C9.2 C10.2 C11.2 C12.2 C13.2 C14.2 C15.2 C16.2 C17.2 C18.2 C19.2 C20.2 C21.2 R5.2 R7.1 U2.A9(VSS) U2.B1(VSSQ) U2.B3(VSS) U2.B9(VSSQ) U2.D1(VSSQ) U2.D8(VSSQ) U2.E1(VSS) U2.E2(VSSQ) U2.E8(VSSQ) U2.F9(VSSQ) U2.G1(VSSQ) U2.G8(VSS) U2.G9(VSSQ) U2.J2(VSS) U2.J8(VSS) U2.M1(VSS) U2.M9(VSS) U2.P1(VSS) U2.P9(VSS) U2.T1(VSS) U2.T9(VSS)
VTTREF: C19.1 C20.1 C21.1 U1.H7(PS_DDR_VREF0_502) U1.P7(PS_DDR_VREF1_502) U2.H1(VREFDQ) U2.M8(VREFCA)
DDR3_A0: U1.M4(PS_DDR_A0_502) U2.N3(A0) ; port DDR3_A0
DDR3_A1: U1.M5(PS_DDR_A1_502) U2.P7(A1) ; port DDR3_A1
DDR3_A2: U1.K4(PS_DDR_A2_502) U2.P3(A2) ; port DDR3_A2
DDR3_A3: U1.L4(PS_DDR_A3_502) U2.N2(A3) ; port DDR3_A3
DDR3_A4: U1.K6(PS_DDR_A4_502) U2.P8(A4) ; port DDR3_A4
DDR3_A5: U1.K5(PS_DDR_A5_502) U2.P2(A5) ; port DDR3_A5
DDR3_A6: U1.J7(PS_DDR_A6_502) U2.R8(A6) ; port DDR3_A6
DDR3_A7: U1.J6(PS_DDR_A7_502) U2.R2(A7) ; port DDR3_A7
DDR3_A8: U1.J5(PS_DDR_A8_502) U2.T8(A8) ; port DDR3_A8
DDR3_A9: U1.H5(PS_DDR_A9_502) U2.R3(A9) ; port DDR3_A9
DDR3_A10: U1.J3(PS_DDR_A10_502) U2.L7(A10/AP) ; port DDR3_A10
DDR3_A11: U1.G5(PS_DDR_A11_502) U2.R7(A11) ; port DDR3_A11
DDR3_A12: U1.H4(PS_DDR_A12_502) U2.N7(A12/BC#) ; port DDR3_A12
DDR3_A13: U1.F4(PS_DDR_A13_502) U2.T3(A13) ; port DDR3_A13
DDR3_A14: U1.G4(PS_DDR_A14_502) U2.T7(A14) ; port DDR3_A14
DDR3_BA0: U1.L7(PS_DDR_BA0_502) U2.M2(BA0) ; port DDR3_BA0
DDR3_BA1: U1.L6(PS_DDR_BA1_502) U2.N8(BA1) ; port DDR3_BA1
DDR3_BA2: U1.M6(PS_DDR_BA2_502) U2.M3(BA2) ; port DDR3_BA2
DDR3_CAS_B: U1.P3(PS_DDR_CAS_B_502) U2.K3(CAS#) ; port DDR3_CAS_B
DDR3_CK0_N: U1.N5(PS_DDR_CKN_502) U2.K7(CK#) ; port DDR3_CK0_N
DDR3_CK0_P: U1.N4(PS_DDR_CKP_502) U2.J7(CK) ; port DDR3_CK0_P
DDR3_CKE: U1.V3(PS_DDR_CKE_502) U2.K9(CKE) ; port DDR3_CKE
DDR3_CS_B: U1.P6(PS_DDR_CS_B_502) U2.L2(CS#) ; port DDR3_CS_B
DDR3_DM0: U1.B1(PS_DDR_DM0_502) U2.E7(DML)
DDR3_DM1: U1.H3(PS_DDR_DM1_502) U2.D3(DMU)
DDR3_DM2: U1.P1(PS_DDR_DM2_502) ; port DDR3_DM2
DDR3_DM3: U1.AA2(PS_DDR_DM3_502) ; port DDR3_DM3
DDR3_DQ0: U1.B2(PS_DDR_DQ2_502) U2.E3(DQL0)
DDR3_DQ1: U1.F1(PS_DDR_DQ7_502) U2.F7(DQL1)
DDR3_DQ2: U1.C3(PS_DDR_DQ1_502) U2.F2(DQL2)
DDR3_DQ3: U1.E3(PS_DDR_DQ4_502) U2.F8(DQL3)
DDR3_DQ4: U1.D1(PS_DDR_DQ0_502) U2.H3(DQL4)
DDR3_DQ5: U1.F2(PS_DDR_DQ6_502) U2.H8(DQL5)
DDR3_DQ6: U1.D3(PS_DDR_DQ3_502) U2.G2(DQL6)
DDR3_DQ7: U1.E1(PS_DDR_DQ5_502) U2.H7(DQL7)
DDR3_DQ8: U1.J1(PS_DDR_DQ14_502) U2.D7(DQU0)
DDR3_DQ9: U1.G1(PS_DDR_DQ9_502) U2.C3(DQU1)
DDR3_DQ10: U1.L1(PS_DDR_DQ10_502) U2.C8(DQU2)
DDR3_DQ11: U1.L2(PS_DDR_DQ11_502) U2.C2(DQU3)
DDR3_DQ12: U1.K1(PS_DDR_DQ13_502) U2.A7(DQU4)
DDR3_DQ13: U1.K3(PS_DDR_DQ15_502) U2.A2(DQU5)
DDR3_DQ14: U1.L3(PS_DDR_DQ12_502) U2.B8(DQU6)
DDR3_DQ15: U1.G2(PS_DDR_DQ8_502) U2.A3(DQU7)
DDR3_DQ16: U1.M1(PS_DDR_DQ16_502) ; port DDR3_DQ16
DDR3_DQ17: U1.R1(PS_DDR_DQ23_502) ; port DDR3_DQ17
DDR3_DQ18: U1.M2(PS_DDR_DQ22_502) ; port DDR3_DQ18
DDR3_DQ19: U1.N3(PS_DDR_DQ18_502) ; port DDR3_DQ19
DDR3_DQ20: U1.R3(PS_DDR_DQ20_502) ; port DDR3_DQ20
DDR3_DQ21: U1.T2(PS_DDR_DQ21_502) ; port DDR3_DQ21
DDR3_DQ22: U1.T1(PS_DDR_DQ19_502) ; port DDR3_DQ22
DDR3_DQ23: U1.T3(PS_DDR_DQ17_502) ; port DDR3_DQ23
DDR3_DQ24: U1.U1(PS_DDR_DQ25_502) ; port DDR3_DQ24
DDR3_DQ25: U1.AA1(PS_DDR_DQ26_502) ; port DDR3_DQ25
DDR3_DQ26: U1.AA3(PS_DDR_DQ24_502) ; port DDR3_DQ26
DDR3_DQ27: U1.W1(PS_DDR_DQ28_502) ; port DDR3_DQ27
DDR3_DQ28: U1.Y3(PS_DDR_DQ29_502) ; port DDR3_DQ28
DDR3_DQ29: U1.Y1(PS_DDR_DQ31_502) ; port DDR3_DQ29
DDR3_DQ30: U1.U2(PS_DDR_DQ27_502) ; port DDR3_DQ30
DDR3_DQ31: U1.W3(PS_DDR_DQ30_502) ; port DDR3_DQ31
DDR3_DQS0_N: U1.D2(PS_DDR_DQS_N0_502) U2.G3(DQSL#)
DDR3_DQS0_P: U1.C2(PS_DDR_DQS_P0_502) U2.F3(DQSL)
DDR3_DQS1_N: U1.J2(PS_DDR_DQS_N1_502) U2.B7(DQSU#)
DDR3_DQS1_P: U1.H2(PS_DDR_DQS_P1_502) U2.C7(DQSU)
DDR3_DQS2_N: U1.P2(PS_DDR_DQS_N2_502) ; port DDR3_DQS2_N
DDR3_DQS2_P: U1.N2(PS_DDR_DQS_P2_502) ; port DDR3_DQS2_P
DDR3_DQS3_N: U1.W2(PS_DDR_DQS_N3_502) ; port DDR3_DQS3_N
DDR3_DQS3_P: U1.V2(PS_DDR_DQS_P3_502) ; port DDR3_DQS3_P
DDR3_ODT: U1.P5(PS_DDR_ODT_502) U2.K1(ODT) ; port DDR3_ODT
DDR3_RAS_B: U1.R5(PS_DDR_RAS_B_502) U2.J3(RAS#) ; port DDR3_RAS_B
DDR3_RESET_B: U1.F3(PS_DDR_DRST_B_502) U2.T2(RESET#) ; port DDR3_RESET_B
DDR3_VRN: R6.2 U1.M7(PS_DDR_VRN_502)
DDR3_VRP: R5.1 U1.N7(PS_DDR_VRP_502)
DDR3_WE_B: U1.R4(PS_DDR_WE_B_502) U2.L3(WE#) ; port DDR3_WE_B
DDR3_ZQ2: R7.2 U2.L8(ZQ)

Not connected (* = marked no-connect by the designer): U2 J1(NC)* J9(NC)* L1(NC)* L9(NC)* M7(NC(A15))*

### Layout directives
differential pair: DDR3_CK0_N, DDR3_CK0_P, DDR3_DQS0_N, DDR3_DQS0_P, DDR3_DQS1_N, DDR3_DQS1_P, DDR3_DQS2_N, DDR3_DQS2_P, DDR3_DQS3_N, DDR3_DQS3_P
net class DDR3_CNTRL: DDR3_BA0, DDR3_BA1, DDR3_BA2, DDR3_CAS_B, DDR3_CKE, DDR3_CS_B, DDR3_ODT, DDR3_RAS_B, DDR3_RESET_B, DDR3_WE_B
net class DDR3_CK: DDR3_CK0_N, DDR3_CK0_P
net class DDR3_DQ1(8-15): DDR3_DM1, DDR3_DQ8, DDR3_DQ9, DDR3_DQ10, DDR3_DQ11, DDR3_DQ12, DDR3_DQ13, DDR3_DQ14, DDR3_DQ15
net class DDR3_DQ0(0-7): DDR3_DM0, DDR3_DQ0, DDR3_DQ1, DDR3_DQ2, DDR3_DQ3, DDR3_DQ4, DDR3_DQ5, DDR3_DQ6, DDR3_DQ7
net class DDR3_DQS1: DDR3_DQS1_N, DDR3_DQS1_P
net class DDR3_DQS0: DDR3_DQS0_N, DDR3_DQS0_P
net class Power_DDR: 1.5V
net class DDR3_ADDR: DDR3_A0, DDR3_A1, DDR3_A2, DDR3_A3, DDR3_A4, DDR3_A5, DDR3_A6, DDR3_A7, DDR3_A8, DDR3_A9, DDR3_A10, DDR3_A11, DDR3_A12, DDR3_A13, DDR3_A14

### Notes on the sheet
- Layout Note:
  DDR3 target trace impedances are as follows:
  Single Ended Signals = 40 ohms
  Differential Signals = 80 ohms
- Layout Note:
  DDR3 trace lengths must include Zynq package flight times.
  See UG933 and Layout Guidelines.
- REV.
- DESCRIPTION
- DATE
- APPROVED
- Incal Inc.
- SHEET
- TITLE
- CONFIG.
- PROJECT
- SIZE
- SCH P/N.
- DRAWN
- B
- OF

### Library data of the parts
C1 C10 = C0805_47uF_10%_25V_X5R: Capacitor ceramic, X5R, 47uF, 6.3V, 20%, -55 to +85 C,; Manufacturer 1: Taiyo; Mfg Part Number 1: JMK212BJ476MG-T; EIA(I) Package: 0805; EIA(M) Package: 2012; ASSY: USED; Status: Active; Power: *; Current: *; Part Ref: C0805_47uF_10%_25V_X5R; Comment_1: *; RoHs: True; Tolerance: 20%; Voltage: 6.3V; Operating Temp: -55 to +85 C
C2-C5 C11-C14 = C0201_0.1uF_10%_6.3V_X5R: as C258 on sheet Bank0-13-33; Status: Active; Power: *; Current: *; Part Ref: C0201_0.1uF_10%_6.3V_X5R; Comment_1: *; RoHs: True; Tolerance: 10%; Voltage: 6.3V; Operating Temp: -55 to +85 C
C6-C9 C15-C21 = C0201_0.01uF_10%_6.3V_X5R: Capacitor ceramic, X5R, 0.01uF, 6.3V, 10%, -55 to +125 C, EIA0201; Manufacturer 1: Murata; Mfg Part Number 1: GRM033R60J103KA01D; EIA(I) Package: 0201; EIA(M) Package: 0603; ASSY: USED; Status: Active; Power: *; Current: *; Part Ref: C0201_0.01uF_10%_6.3V_X5R; Comment_1: *; RoHs: True; Operating Temp: -55 to +85 C
  C6-C9 C15-C18: Tolerance: 10%; Voltage: 6.3V
R5 R6 = R0402_80R6_1%: Resistor, 80R6, 1/16W, 1%, -50 to +155 C, EIA0402, EIA(M)1005; Manufacturer 1: Yageo; Mfg Part Number 1: RC0402FR-0780R6L; EIA(I) Package: 0402; EIA(M) Package: 1005; Voltage: 50V; ASSY: USED; Status: Active; Part Ref: R0402_80R6_1%; Current: *; Comment_1: *; RoHs: True; Power: 1/16W; Operating Temp: -50 to +155 C; Datasheet 1: ..\datasheet\Resistor\Yaego\Thick_Film\RC0402\2012-03-29; Manufacturer 2: Vishay Dale; Mfg Part Number 2: CRCW040280R6FKED; Datasheet 2: ..\datasheet\Resistor\Vishay Dale\CRC\2012-03-29
R7 = R0402_240R_1%: as R4 on sheet Bank0-13-33; Status: Active; Part Ref: R0402_240R_1%; Current: *; Comment_1: *; RoHs: True; Operating Temp: -50 to +155 C
U1 = XC7Z020-1CLG484C: as U1 on sheet Bank0-13-33; DatasheetVersion: v1.2; PackageVersion: Rev 1.1; PackageReference: CLG484; PackageDescription: Wire-Bond Chip-Scale BGA, Body 19 x 19 mm, 0.8 mm Pitch; Generic Part Number: XC7Z020; RoHS: True; Mounting Technology: Surface Mount; Code_JEDEC: MO-275-PPAA-2; PartNumber: XC7Z020-1CLG484C; ComponentLink1Description: Datasheet; ComponentLink1URL: http://www.xilinx.com/support/documentation/data_sheets/ds190-Zynq-7000-Overview.pdf; ComponentLink2Description: Package Specification; ComponentLink2URL: http://www.xilinx.com/support/documentation/user_guides/ug865-Zynq-7000-Pkg-Pinout.pdf; ComponentLink3Description: DC and AC Switching Characteristics; ComponentLink3URL: http://www.xilinx.com/support/documentation/data_sheets/ds187-XC7Z010-XC7Z020-Data-Sheet.pdf; ComponentLink4Description: Package File; ComponentLink4URL: http://www.xilinx.com/support/packagefiles/z7packages/xc7z020clg484pkg.txt; ComponentLink5Description: Packaging and Pinout; ComponentLink5URL: http://www.xilinx.com/support/documentation/user_guides/ug865-Zynq-7000-Pkg-Pinout.pdf; ComponentLink6Description: PCB and Layout Guide; ComponentLink6URL: http://www.xilinx.com/support/documentation/user_guides/ug483_7Series_PCB.pdf; Part Ref: XC7Z020-1CLG484C; Status: Active; Value: XC7Z020-1CLG484C; Manufacturer 1: Xilinx; Mfg Part Number 1: XC7Z020-1CLG484C; Package: CLG484
U2 = IS43TR16256A-125KBLI: DDR3 SDRAM, 512Mx8, 256Mx16 4Gb; Manufacturer 1: ISSI; PART NUMBER: IS43TR16256A-125KBLI; Part Ref: IS43TR16256A-125KBLI; Status: Active; RoHs: False; Value: IS43TR16256A-125KBLI; Mfg Part Number 1: IS43TR16256A-125KBLI

## Sheet Ethernet.SchDoc: 02290_Sonoma_Controller
size B; ApprovedBy: J Johnson; CheckedBy: J Johnson; Author: sdfasdfdfAEFfasdFfaF; DrawnBy: J Johnson; Organization: Opsero Electronic Design; Address1: 21-915 Av. Marguerite-Bourgeoys; Address2: Québec (QC); Address3: G1S 3X4; DocumentNumber: OP009-001-SCH; Revision: B-1; SheetNumber: 05; SheetTotal: 16; Tel1: (581) 308-8830; Tel2: (581) 308-8830; Project: 02290_Sonoma_Controller; CheckedDate: 2013-12-13; Sheet: Ethernet PHY; PageSetup: Record=PageOptions|CenterHorizontal=True|CenterVertical=True|PrintScale=1.08|XCorrection=1.00|YCorrection=1.00|PrintKind=0|BorderSize=5000000|LeftOffset=0|BottomOffset=0|Orientation=2|PaperLength=1000|PaperWidth=1000|Scale=100|PaperSource=7|PrintQuality=-4|MediaType=1|DitherType=10|PaperKind=Tabloid     [11 x 17 in]|PrintScaleMode=1; DrawDate: 2013-12-13; SchTitle: 02290_Sonoma_Controller; RevDescription: Removed QSPI, JP4/5, temp mon, JP6, U31; RevDate: 2019-05-24; RevBy: J Johnson; RevDescription2: Replaced D1 with RB521S30, J2 with L834-1G1T-S7; RevDescription3: Replaced FETs with TSM900N06CW RPG
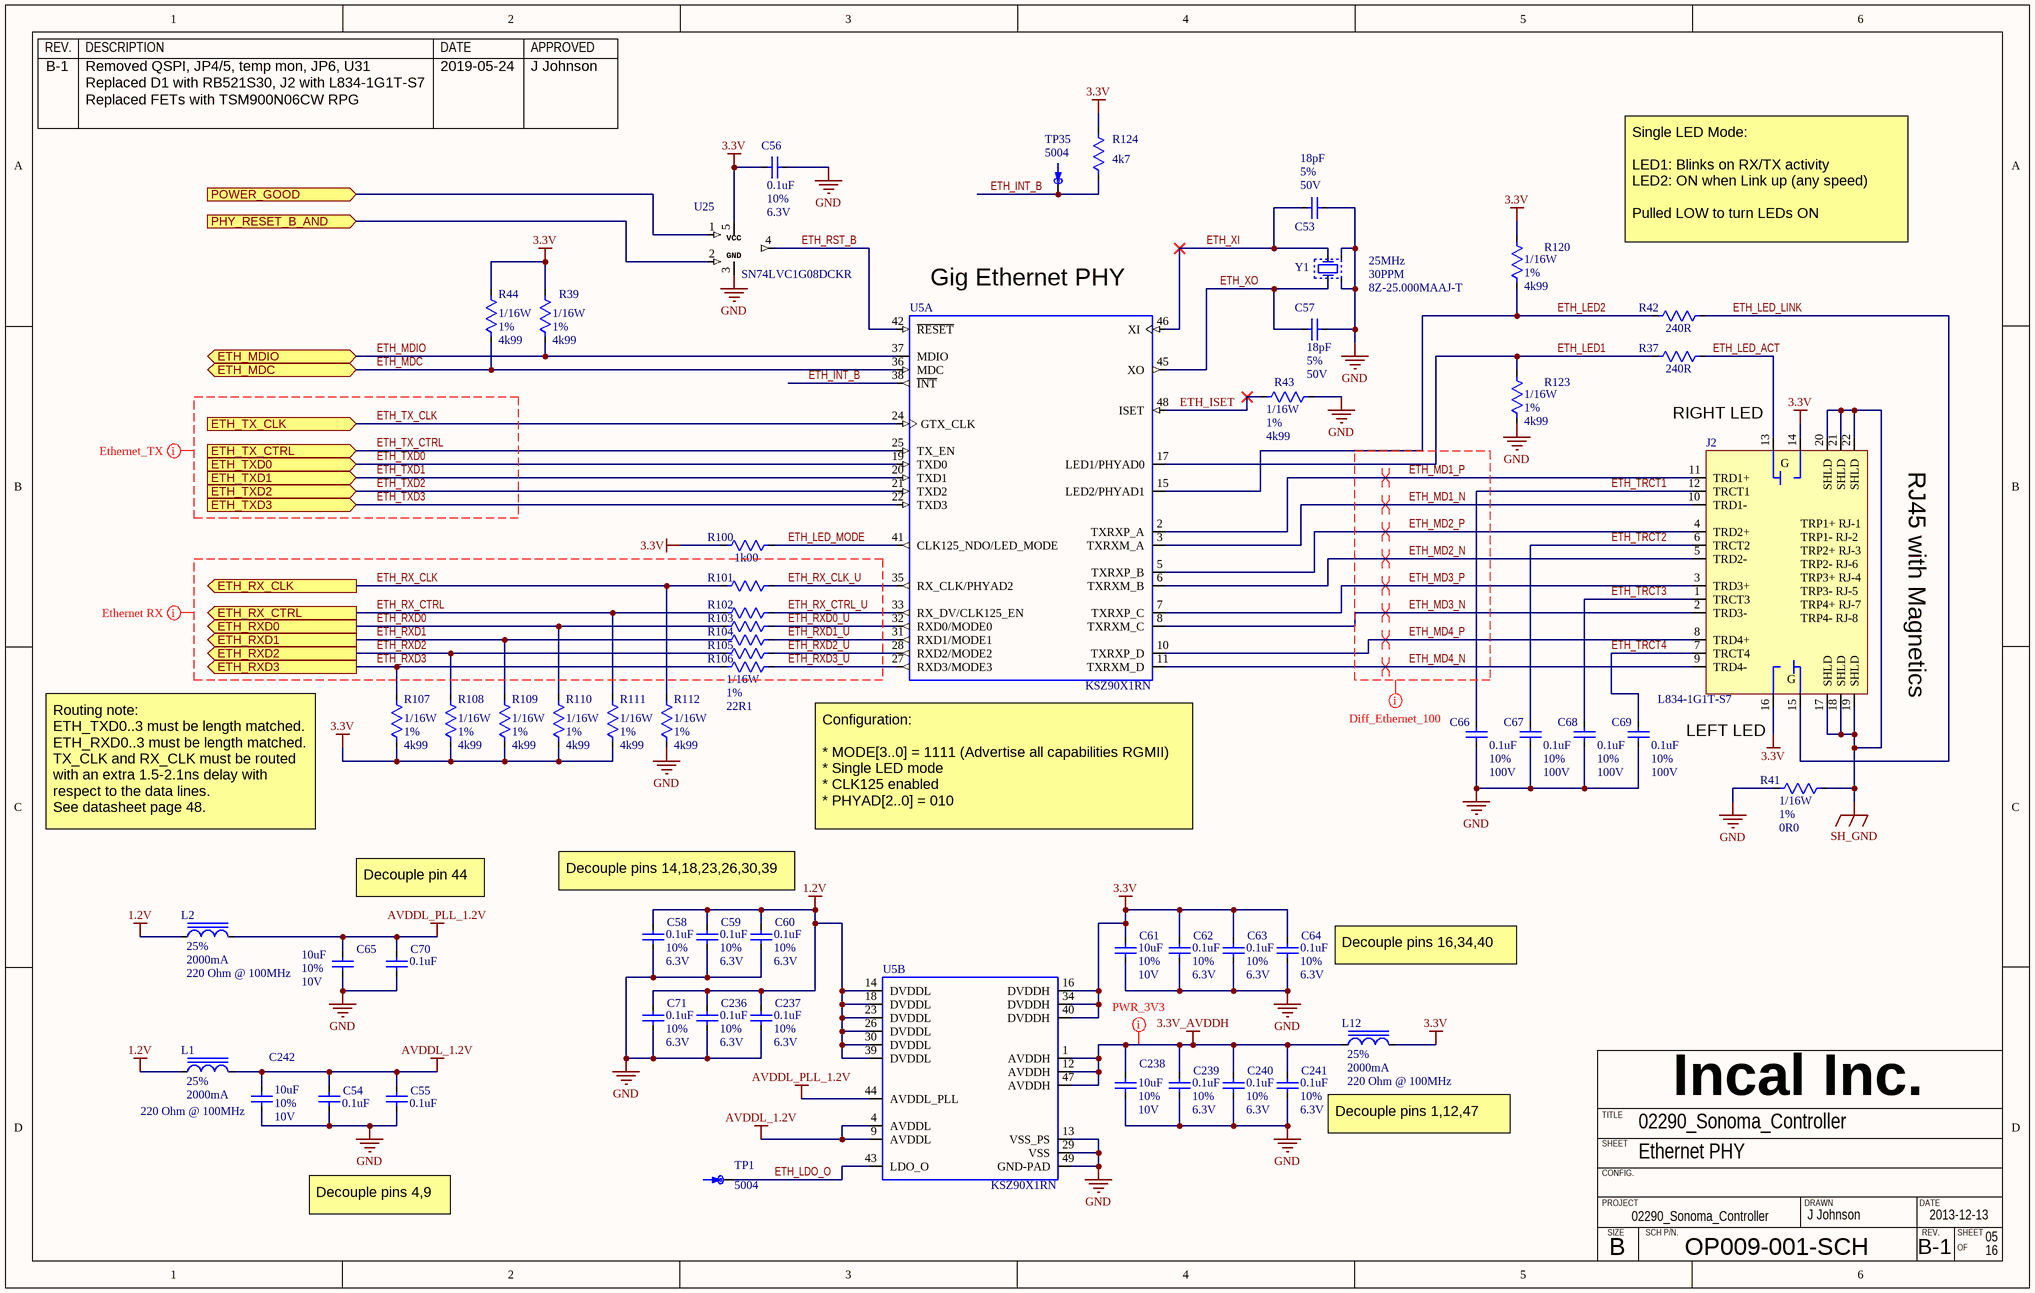
[diagram p3: Ethernet.SchDoc]

### Parts
C53  value 18pF  Tolerance: 5%  Voltage: 50V  [CAPC1005X33N]  (hidden comment: CAPACITOR_NP_TYPE1)
C54  value 0.1uF  [CAPC0603X33N]  (hidden comment: CAPACITOR_NP_TYPE1)
C55  value 0.1uF  [CAPC0603X33N]  (hidden comment: CAPACITOR_NP_TYPE1)
C56  value 0.1uF  Tolerance: 10%  Voltage: 6.3V  [CAPC0603X33N]  (hidden comment: CAPACITOR_NP_TYPE1)
C57  value 18pF  Tolerance: 5%  Voltage: 50V  [CAPC1005X33N]  (hidden comment: CAPACITOR_NP_TYPE1)
C58  value 0.1uF  Tolerance: 10%  Voltage: 6.3V  [CAPC0603X33N]  (hidden comment: CAPACITOR_NP_TYPE1)
C59  value 0.1uF  Tolerance: 10%  Voltage: 6.3V  [CAPC0603X33N]  (hidden comment: CAPACITOR_NP_TYPE1)
C60  value 0.1uF  Tolerance: 10%  Voltage: 6.3V  [CAPC0603X33N]  (hidden comment: CAPACITOR_NP_TYPE1)
C61  value 10uF  Tolerance: 10%  Voltage: 10V  [CAPC1608X38N]  (hidden comment: CAPACITOR_NP_TYPE1)
C62  value 0.1uF  Tolerance: 10%  Voltage: 6.3V  [CAPC0603X33N]  (hidden comment: CAPACITOR_NP_TYPE1)
C63  value 0.1uF  Tolerance: 10%  Voltage: 6.3V  [CAPC0603X33N]  (hidden comment: CAPACITOR_NP_TYPE1)
C64  value 0.1uF  Tolerance: 10%  Voltage: 6.3V  [CAPC0603X33N]  (hidden comment: CAPACITOR_NP_TYPE1)
C65  value 10uF  Tolerance: 10%  Voltage: 10V  [CAPC1608X38N]  (hidden comment: CAPACITOR_NP_TYPE1)
C66  value 0.1uF  Tolerance: 10%  Voltage: 100V  [CAPC1608X38N]  (hidden comment: CAPACITOR_NP_TYPE1)
C67  value 0.1uF  Tolerance: 10%  Voltage: 100V  [CAPC1608X38N]  (hidden comment: CAPACITOR_NP_TYPE1)
C68  value 0.1uF  Tolerance: 10%  Voltage: 100V  [CAPC1608X38N]  (hidden comment: CAPACITOR_NP_TYPE1)
C69  value 0.1uF  Tolerance: 10%  Voltage: 100V  [CAPC1608X38N]  (hidden comment: CAPACITOR_NP_TYPE1)
C70  value 0.1uF  [CAPC0603X33N]  (hidden comment: CAPACITOR_NP_TYPE1)
C71  value 0.1uF  Tolerance: 10%  Voltage: 6.3V  [CAPC0603X33N]  (hidden comment: CAPACITOR_NP_TYPE1)
C236  value 0.1uF  Tolerance: 10%  Voltage: 6.3V  [CAPC0603X33N]  (hidden comment: CAPACITOR_NP_TYPE1)
C237  value 0.1uF  Tolerance: 10%  Voltage: 6.3V  [CAPC0603X33N]  (hidden comment: CAPACITOR_NP_TYPE1)
C238  value 10uF  Tolerance: 10%  Voltage: 10V  [CAPC1608X38N]  (hidden comment: CAPACITOR_NP_TYPE1)
C239  value 0.1uF  Tolerance: 10%  Voltage: 6.3V  [CAPC0603X33N]  (hidden comment: CAPACITOR_NP_TYPE1)
C240  value 0.1uF  Tolerance: 10%  Voltage: 6.3V  [CAPC0603X33N]  (hidden comment: CAPACITOR_NP_TYPE1)
C241  value 0.1uF  Tolerance: 10%  Voltage: 6.3V  [CAPC0603X33N]  (hidden comment: CAPACITOR_NP_TYPE1)
C242  value 10uF  Tolerance: 10%  Voltage: 10V  [CAPC1608X38N]  (hidden comment: CAPACITOR_NP_TYPE1)
J2  value L834-1G1T-S7  [L834-1G1T-S7]  (hidden comment: CON_RJ45_MAG_TYPE_9)
L1  value 220 Ohm @ 100MHz  Tolerance: 25%  Current: 2000mA  [INDC2012X85N]  (hidden comment: INDUCTOR_CORE_TYPE1)
L2  value 220 Ohm @ 100MHz  Tolerance: 25%  Current: 2000mA  [INDC2012X85N]  (hidden comment: INDUCTOR_CORE_TYPE1)
L12  value 220 Ohm @ 100MHz  Tolerance: 25%  Current: 2000mA  [INDC2012X85N]  (hidden comment: INDUCTOR_CORE_TYPE1)
R37  value 240R  [RESC1005X33N]  (hidden comment: *)
R39  value 4k99  Power: 1/16W  Tolerance: 1%  [RESC1005X33N]  (hidden comment: *)
R41  value 0R0  Power: 1/16W  Tolerance: 1%  [RESC1005X33N]  (hidden comment: *)
R42  value 240R  [RESC1005X33N]  (hidden comment: *)
R43  value 4k99  Power: 1/16W  Tolerance: 1%  [RESC1005X33N]  (hidden comment: *)
R44  value 4k99  Power: 1/16W  Tolerance: 1%  [RESC1005X33N]  (hidden comment: *)
R100  value 1k00  [RESC1005X33N]  (hidden comment: *)
R101  *  [RESC1005X33N]  (value not drawn)
R102  *  [RESC1005X33N]  (value not drawn)
R103  *  [RESC1005X33N]  (value not drawn)
R104  *  [RESC1005X33N]  (value not drawn)
R105  *  [RESC1005X33N]  (value not drawn)
R106  value 22R1  Power: 1/16W  Tolerance: 1%  [RESC1005X33N]  (hidden comment: *)
R107  value 4k99  Power: 1/16W  Tolerance: 1%  [RESC1005X33N]  (hidden comment: *)
R108  value 4k99  Power: 1/16W  Tolerance: 1%  [RESC1005X33N]  (hidden comment: *)
R109  value 4k99  Power: 1/16W  Tolerance: 1%  [RESC1005X33N]  (hidden comment: *)
R110  value 4k99  Power: 1/16W  Tolerance: 1%  [RESC1005X33N]  (hidden comment: *)
R111  value 4k99  Power: 1/16W  Tolerance: 1%  [RESC1005X33N]  (hidden comment: *)
R112  value 4k99  Power: 1/16W  Tolerance: 1%  [RESC1005X33N]  (hidden comment: *)
R120  value 4k99  Power: 1/16W  Tolerance: 1%  [RESC1005X33N]  (hidden comment: *)
R123  value 4k99  Power: 1/16W  Tolerance: 1%  [RESC1005X33N]  (hidden comment: *)
R124  value 4k7  [RESC1005X33N]  (hidden comment: *)
TP1  value 5004  [KEY_5004]  (hidden comment: TEST_POINT_TYPE4)
TP35  value 5004  [KEY_5004]  (hidden comment: TEST_POINT_TYPE4)
U5  KSZ90X1RN  [QFN50P700X700X90-49N]  (value not drawn)  (parts A,B of 2)
U25  value SN74LVC1G08DCKR  [SOT65P210X110-5N]  (hidden comment: SN74LVC1G08)
Y1  value 25MHz  Tolerance: 30PPM  Mfg Part Number 1: 8Z-25.000MAAJ-T  [OSCSC185P200X250X55-4N]  (hidden comment: *)

### Ports
ETH_MDC (bidir), ETH_MDIO (bidir), ETH_RX_CLK (out), ETH_RX_CTRL (out), ETH_RXD0 (out), ETH_RXD1 (out), ETH_RXD2 (out), ETH_RXD3 (out), ETH_TX_CLK (in), ETH_TX_CTRL (in), ETH_TXD0 (in), ETH_TXD1 (in), ETH_TXD2 (in), ETH_TXD3 (in), PHY_RESET_B_AND (in), POWER_GOOD (in)

### Nets
1.2V: C58.1 C59.1 C60.1 C71.1 C236.1 C237.1 L1.1 L2.1 U5.14(DVDDL) U5.18(DVDDL) U5.23(DVDDL) U5.26(DVDDL) U5.30(DVDDL) U5.39(DVDDL)
3.3V: C56.1 C61.1 C62.1 C63.1 C64.1 J2.14(A2) J2.16(A1) L12.2 R39.2 R44.2 R100.1 R107.1 R108.1 R109.1 R110.1 R111.1 R120.2 R124.1 U5.16(DVDDH) U5.34(DVDDH) U5.40(DVDDH) U25.5(VCC)
3.3V_AVDDH: C238.1 C239.1 C240.1 C241.1 L12.1 U5.1(AVDDH) U5.12(AVDDH) U5.47(AVDDH)
AVDDL_1.2V: C54.1 C55.1 C242.1 L1.2 U5.4(AVDDL) U5.9(AVDDL)
AVDDL_PLL_1.2V: C65.1 C70.1 L2.2 U5.44(AVDDL_PLL)
GND: C53.2 C54.2 C55.2 C56.2 C57.2 C58.2 C59.2 C60.2 C61.2 C62.2 C63.2 C64.2 C65.2 C66.2 C67.2 C68.2 C69.2 C70.2 C71.2 C236.2 C237.2 C238.2 C239.2 C240.2 C241.2 C242.2 R41.1 R43.1 R112.1 R123.1 U5.13(VSS_PS) U5.29(VSS) U5.49(GND-PAD) U25.3(GND) Y1.2 Y1.4
SH_GND: J2.17(SHLD) J2.18(SHLD) J2.19(SHLD) J2.20(SHLD) J2.21(SHLD) J2.22(SHLD) R41.2
ETH_INT_B: R124.2 TP35.1 U5.38(~{INT})
ETH_ISET: R43.2 U5.48(ISET)
ETH_LDO_O: TP1.1 U5.43(LDO_O)
ETH_LED1: R37.1 R123.2 U5.17(LED1/PHYAD0)
ETH_LED2: R42.1 R120.1 U5.15(LED2/PHYAD1)
ETH_LED_ACT: J2.13(K2) R37.2
ETH_LED_LINK: J2.15 R42.2
ETH_LED_MODE: R100.2 U5.41(CLK125_NDO/LED_MODE)
ETH_MD1_N: J2.10(TRD1-) U5.3(TXRXM_A)
ETH_MD1_P: J2.11(TRD1+) U5.2(TXRXP_A)
ETH_MD2_N: J2.5(TRD2-) U5.6(TXRXM_B)
ETH_MD2_P: J2.4(TRD2+) U5.5(TXRXP_B)
ETH_MD3_N: J2.2(TRD3-) U5.8(TXRXM_C)
ETH_MD3_P: J2.3(TRD3+) U5.7(TXRXP_C)
ETH_MD4_N: J2.9(TRD4-) U5.11(TXRXM_D)
ETH_MD4_P: J2.8(TRD4+) U5.10(TXRXP_D)
ETH_MDC: R44.1 U5.36(MDC) ; port ETH_MDC
ETH_MDIO: R39.1 U5.37(MDIO) ; port ETH_MDIO
ETH_RST_B: U5.42(~{RESET}) U25.4(Y)
ETH_RX_CLK: R101.1 R112.2 ; port ETH_RX_CLK
ETH_RX_CLK_U: R101.2 U5.35(RX_CLK/PHYAD2)
ETH_RX_CTRL: R102.1 R111.2 ; port ETH_RX_CTRL
ETH_RX_CTRL_U: R102.2 U5.33(RX_DV/CLK125_EN)
ETH_RXD0: R103.1 R110.2 ; port ETH_RXD0
ETH_RXD0_U: R103.2 U5.32(RXD0/MODE0)
ETH_RXD1: R104.1 R109.2 ; port ETH_RXD1
ETH_RXD1_U: R104.2 U5.31(RXD1/MODE1)
ETH_RXD2: R105.1 R108.2 ; port ETH_RXD2
ETH_RXD2_U: R105.2 U5.28(RXD2/MODE2)
ETH_RXD3: R106.1 R107.2 ; port ETH_RXD3
ETH_RXD3_U: R106.2 U5.27(RXD3/MODE3)
ETH_TRCT1: C66.1 J2.12(TRCT1)
ETH_TRCT2: C67.1 J2.6(TRCT2)
ETH_TRCT3: C68.1 J2.1(TRCT3)
ETH_TRCT4: C69.1 J2.7(TRCT4)
ETH_TX_CLK: U5.24(GTX_CLK) ; port ETH_TX_CLK
ETH_TX_CTRL: U5.25(TX_EN) ; port ETH_TX_CTRL
ETH_TXD0: U5.19(TXD0) ; port ETH_TXD0
ETH_TXD1: U5.20(TXD1) ; port ETH_TXD1
ETH_TXD2: U5.21(TXD2) ; port ETH_TXD2
ETH_TXD3: U5.22(TXD3) ; port ETH_TXD3
ETH_XI: C53.1 U5.46(XI) Y1.3
ETH_XO: C57.1 U5.45(XO) Y1.1
PHY_RESET_B_AND: U25.2(B) ; port PHY_RESET_B_AND
POWER_GOOD: U25.1(A) ; port POWER_GOOD

### Layout directives
differential pair: ETH_MD1_N, ETH_MD1_P, ETH_MD2_N, ETH_MD2_P, ETH_MD3_N, ETH_MD3_P, ETH_MD4_N, ETH_MD4_P
net class Power_3V3: 3.3V_AVDDH
net class Ethernet_TX: ETH_TX_CLK, ETH_TX_CTRL, ETH_TXD0, ETH_TXD1, ETH_TXD2, ETH_TXD3
net class Ethernet RX: ETH_RX_CLK, ETH_RX_CLK_U, ETH_RX_CTRL, ETH_RX_CTRL_U, ETH_RXD0, ETH_RXD0_U, ETH_RXD1, ETH_RXD1_U, ETH_RXD2, ETH_RXD2_U, ETH_RXD3, ETH_RXD3_U
net class Diff_Ethernet_100: ETH_MD1_N, ETH_MD1_P, ETH_MD2_N, ETH_MD2_P, ETH_MD3_N, ETH_MD3_P, ETH_MD4_N, ETH_MD4_P

### Notes on the sheet
- Single LED Mode:
  LED1: Blinks on RX/TX activity
  LED2: ON when Link up (any speed)
  Pulled LOW to turn LEDs ON
- (near U5) Gig Ethernet PHY
- (near J2) RIGHT LED
- (near J2) RJ45 with Magnetics
- (near J2) LEFT LED
- Routing note:
  ETH_TXD0..3 must be length matched.
  ETH_RXD0..3 must be length matched.
  TX_CLK and RX_CLK must be routed with an extra 1.5-2.1ns delay with respect to the data lines.
  See datasheet page 48.
- (near U5) Configuration:
  * MODE[3..0] = 1111 (Advertise all capabilities RGMII)
  * Single LED mode
  * CLK125 enabled
  * PHYAD[2..0] = 010
- Decouple pin 44
- Decouple pins 14,18,23,26,30,39
- (near C64) Decouple pins 16,34,40
- Decouple pins 1,12,47
- Decouple pins 4,9
- REV.
- DESCRIPTION
- DATE
- APPROVED
- Incal Inc.
- SHEET
- TITLE
- CONFIG.
- PROJECT
- SIZE
- SCH P/N.
- DRAWN
- B
- OF
- (in symbol L834-1G1T-S7) G; TRP1+ RJ-1; TRP1- RJ-2; TRP2+ RJ-3; TRP2- RJ-6; TRP3+ RJ-4; TRP3- RJ-5; TRP4+ RJ-7; TRP4- RJ-8

### Library data of the parts
C53 C57 = C0402_18pF_5%_50V_C0G: Capacitor ceramic, C0G (NP0), 18pF, 50V, 5%, -55 to +125 C, EIA0402; Manufacturer 1: Murata; Mfg Part Number 1: GRM1555C1H180JZ01D; EIA(I) Package: 0402; EIA(M) Package: 1005; ASSY: USED; Status: Active; Power: *; Current: *; Part Ref: C0402_18pF_5%_50V_C0G; Comment_1: *; RoHs: True; Operating Temp: -55 to +125 C; Datasheet 1: ..\datasheet\Capacitor\Murata\GRM_Serie\Series catalog\2013-04-30
C54-C56 C58-C60 C62-C64 C70 C71 C236 C237 C239-C241 = C0201_0.1uF_10%_6.3V_X5R: as C258 on sheet Bank0-13-33; Status: Active; Power: *; Current: *; Part Ref: C0201_0.1uF_10%_6.3V_X5R; Comment_1: *; RoHs: True; Operating Temp: -55 to +85 C
  C54 C55 C70: Tolerance: 10%; Voltage: 6.3V
C61 C65 C238 C242 = C0603_10uF_10%_10V_X5R: as C259 on sheet Bank0-13-33; Status: Active; Power: *; Current: *; Part Ref: C0603_10uF_10%_10V_X5R; Comment_1: *; RoHs: True; Operating Temp: -55 to +85 C
C66-C69 = C0603_0.1uF_10%_100V_X7R: Capacitor ceramic, X7R, 0.1uF, 100V, 10%, -55 to +125 C, EIA0603; Manufacturer 1: Murata; Mfg Part Number 1: GRM188R72A104KA35D; EIA(I) Package: 0603; EIA(M) Package: 1608; ASSY: USED; Status: Active; Power: *; Current: *; Part Ref: C0603_0.1uF_10%_100V_X7R; Comment_1: *; RoHs: True; Operating Temp: -55 to +125 C; Datasheet 1: ..\datasheet\Capacitor\Murata\GRM_Serie\GRM188R72A_X7R\2012-06-24
J2 = L834-1G1T-S7: Connector RJ45, 10/100/1000, with Mag & 2 LED G/G, Tab down; Manufacturer 1: Bel Fuse; Status: Active; EIA(I) Package: *; EIA(M) Package: *; Part Ref: L834-1G1T-S7; Tolerance: *; Package: *; RoHs: True; Datasheet 1: https://www.belfuse.com/resources/ICMs/ICMs%20Drawings/L834-1G1T-S7.pdf; Mfg Part Number 1: L834-1G1T-S7; Operating Temp: -
L1 L2 L12 = BLM21PG221SN1D: Ferrite chip, 220 Ohm @ 100MHz, 2000mA, 25%, -55 to +125 C, 0805; Manufacturer 1: Murata; EIA(I) Package: 0805; EIA(M) Package: 2012; ASSY: USED; Status: Active; Power: *; Part Ref: BLM21PG221SN1D; Voltage: *; Comment_1: *; RoHs: True; Operating Temp: -55 to +125 C; Mfg Part Number 1: BLM21PG221SN1D
R37 R42 = R0402_240R_1%: as R4 on sheet Bank0-13-33; Status: Active; Part Ref: R0402_240R_1%; Current: *; Comment_1: *; RoHs: True; Power: 1/16W; Tolerance: 1%; Operating Temp: -50 to +155 C
R39 R43 R44 R107-R112 R120 R123 = R0402_4k99_1%: Resistor, 4k99, 1/16W, 1%, -50 to +155 C, EIA0402, EIA(M)1005; Manufacturer 1: Yageo; Mfg Part Number 1: RC0402FR-074k99L; EIA(I) Package: 0402; EIA(M) Package: 1005; Voltage: 50V; ASSY: USED; Status: Active; Part Ref: R0402_4k99_1%; Current: *; Comment_1: *; RoHs: True; Operating Temp: -50 to +155 C; Datasheet 1: ..\datasheet\Resistor\Yaego\Thick_Film\RC0402\2012-03-29; Manufacturer 2: Vishay Dale; Mfg Part Number 2: CRCW04024k99FKED; Datasheet 2: ..\datasheet\Resistor\Vishay Dale\CRC\2012-03-29
R41 = R0402_0R0_1%: Resistor, 0R0, 1/16W, 1%, -50 to +155 C, EIA0402, EIA(M)1005; Manufacturer 1: Yageo; Mfg Part Number 1: RC0402FR-070RL; EIA(I) Package: 0402; EIA(M) Package: 1005; Voltage: 50V; ASSY: USED; Status: Active; Part Ref: R0402_0R0_1%; Current: *; Comment_1: *; RoHs: True; Package: 0402; Operating Temp: -50 to +155 C; Datasheet 1: ..\datasheet\Resistor\Yaego\Thick_Film\RC0402\2012-03-29; Manufacturer 2: Rohm Semiconductor; Mfg Part Number 2: MCR01MRTJ000; Datasheet 2: ..\datasheet\Resistor\Rohm\2012-08-20
R100 = R0402_1k00_1%: Resistor, 1k00, 1/16W, 1%, -55 to +155 C, EIA0402; Manufacturer 1: Yageo; Mfg Part Number 1: RC0402FR-071K00L; EIA(I) Package: 0402; EIA(M) Package: 1005; Voltage: 50V; ASSY: USED; Status: Active; Part Ref: R0402_1k00_1%; Current: *; Comment_1: *; RoHs: True; Power: 1/16W; Tolerance: 1%; Operating Temp: -55 to +155 C; Datasheet 1: ..\datasheet\Resistor\Yaego\Thick_Film\RC0402\2012-03-29; Manufacturer 2: Vishay Dale; Mfg Part Number 2: CRCW04021k00FKED; Datasheet 2: ..\datasheet\Resistor\Vishay Dale\CRC\2012-03-29
R101-R106 = R0402_22R1_1%: Resistor, 22R1, 1/16W, 1%, -55 to +155 C, EIA0402; Manufacturer 1: Yageo; Mfg Part Number 1: RC0402FR-0722R1L; EIA(I) Package: 0402; EIA(M) Package: 1005; Voltage: 50V; ASSY: USED; Status: Active; Part Ref: R0402_22R1_1%; Current: *; Comment_1: *; RoHs: True; Operating Temp: -55 to +155 C; Datasheet 1: ..\datasheet\Resistor\Yaego\Thick_Film\RC0402\2012-03-29; Manufacturer 2: Vishay Dale; Mfg Part Number 2: CRCW040222R1FKED; Datasheet 2: ..\datasheet\Resistor\Vishay Dale\CRC\2012-03-29
  R101-R105: Power: 1/16W; Tolerance: 1%; Value: 22R1
R124 = R0402_4k70_1%: as R1 on sheet Bank0-13-33; Status: Active; Part Ref: R0402_4k70_1%; Current: *; Comment_1: *; RoHs: True; Power: 1/16W; Tolerance: 1%; Operating Temp: -55 to +155 C; Datasheet 1: ..\datasheet\Resistor\Yaego\Thick_Film\RC0402\2012-03-29; Manufacturer 2: Vishay Dale; Mfg Part Number 2: CRCW04024k70FKED; Datasheet 2: ..\datasheet\Resistor\Vishay Dale\CRC\2012-03-29
TP1 TP35 = 5004: Test point bead, yellow, Keystone Electronics, Thru-hole,; Manufacturer 1: Keystone inc; ASSY: USED; Power: Pow; Current: Cur; Voltage: Vol; Comment_1: Com; Status: Active; EIA(I) Package: *; EIA(M) Package: *; Part Ref: 5004; Tolerance: *; Package: *; RoHs: True; Mfg Part Number 1: 5004; Datasheet 1: ..\datasheet\Connector\Keystone Electronics\5001-5014\2012-06-28
U5 = KSZ9021RNI: 10/100/1000 ethernet PHY with RGMII, 3.3V,1.2V, 0, -40 to +85 C, 0, QFN48; Manufacturer 1: Micrel; ASSY: USED; Power: 0; Status: Active; EIA(I) Package: *; EIA(M) Package: *; Part Ref: KSZ9021RNI; Current: 0; Tolerance: *; Voltage: 3.3V,1.2V; Package: QFN48; RoHs: True; Value: KSZ9021RNI; Operating Temp: -40 to +85 C; Mfg Part Number 1: KSZ9021RNI; Datasheet 1: ..\datasheet\Interface\KSZ9031RNX\2012-10-18; Manufacturer 2: MICREL; Mfg Part Number 2: KSZ9021RNI; Datasheet 2: ..\datasheet\Interface\KSZ9021RN\2012-10-18
U25 = SN74LVC1G08DCKR: Single 2-input AND gate, 1.65V to 5.5V; Manufacturer 1: Texas Instruments; ASSY: USED; Power: Pow; Current: Cur; Comment_1: Com; Status: Active; EIA(I) Package: *; EIA(M) Package: *; Part Ref: SN74LVC1G08DCKR; Tolerance: *; Voltage: 1.65V to 5.5V; Package: SC70-5; RoHs: True; Operating Temp: -40 to 125 C; Mfg Part Number 1: SN74LVC1G08DCKR
Y1 = 8Z-25.000MAAJ-T: Crystal, 25MHz, 30ppm, 100uW, -40 to +85 C, SMT; Manufacturer 1: TXC; ASSY: USED; Status: Active; EIA(I) Package: *; EIA(M) Package: *; Part Ref: 8Z-25.000MAAJ-T; Voltage: *; Current: *; Power: 100uW; Comment_1: *; RoHs: True; Package: 2.0x2.5x0.55mm; Operating Temp: -40 to +85 C